# EAGLE schematic main (EAGLE 8.0.0), part 3 of 4
## Sheet 32 of 48: PC_ADDER 8-15
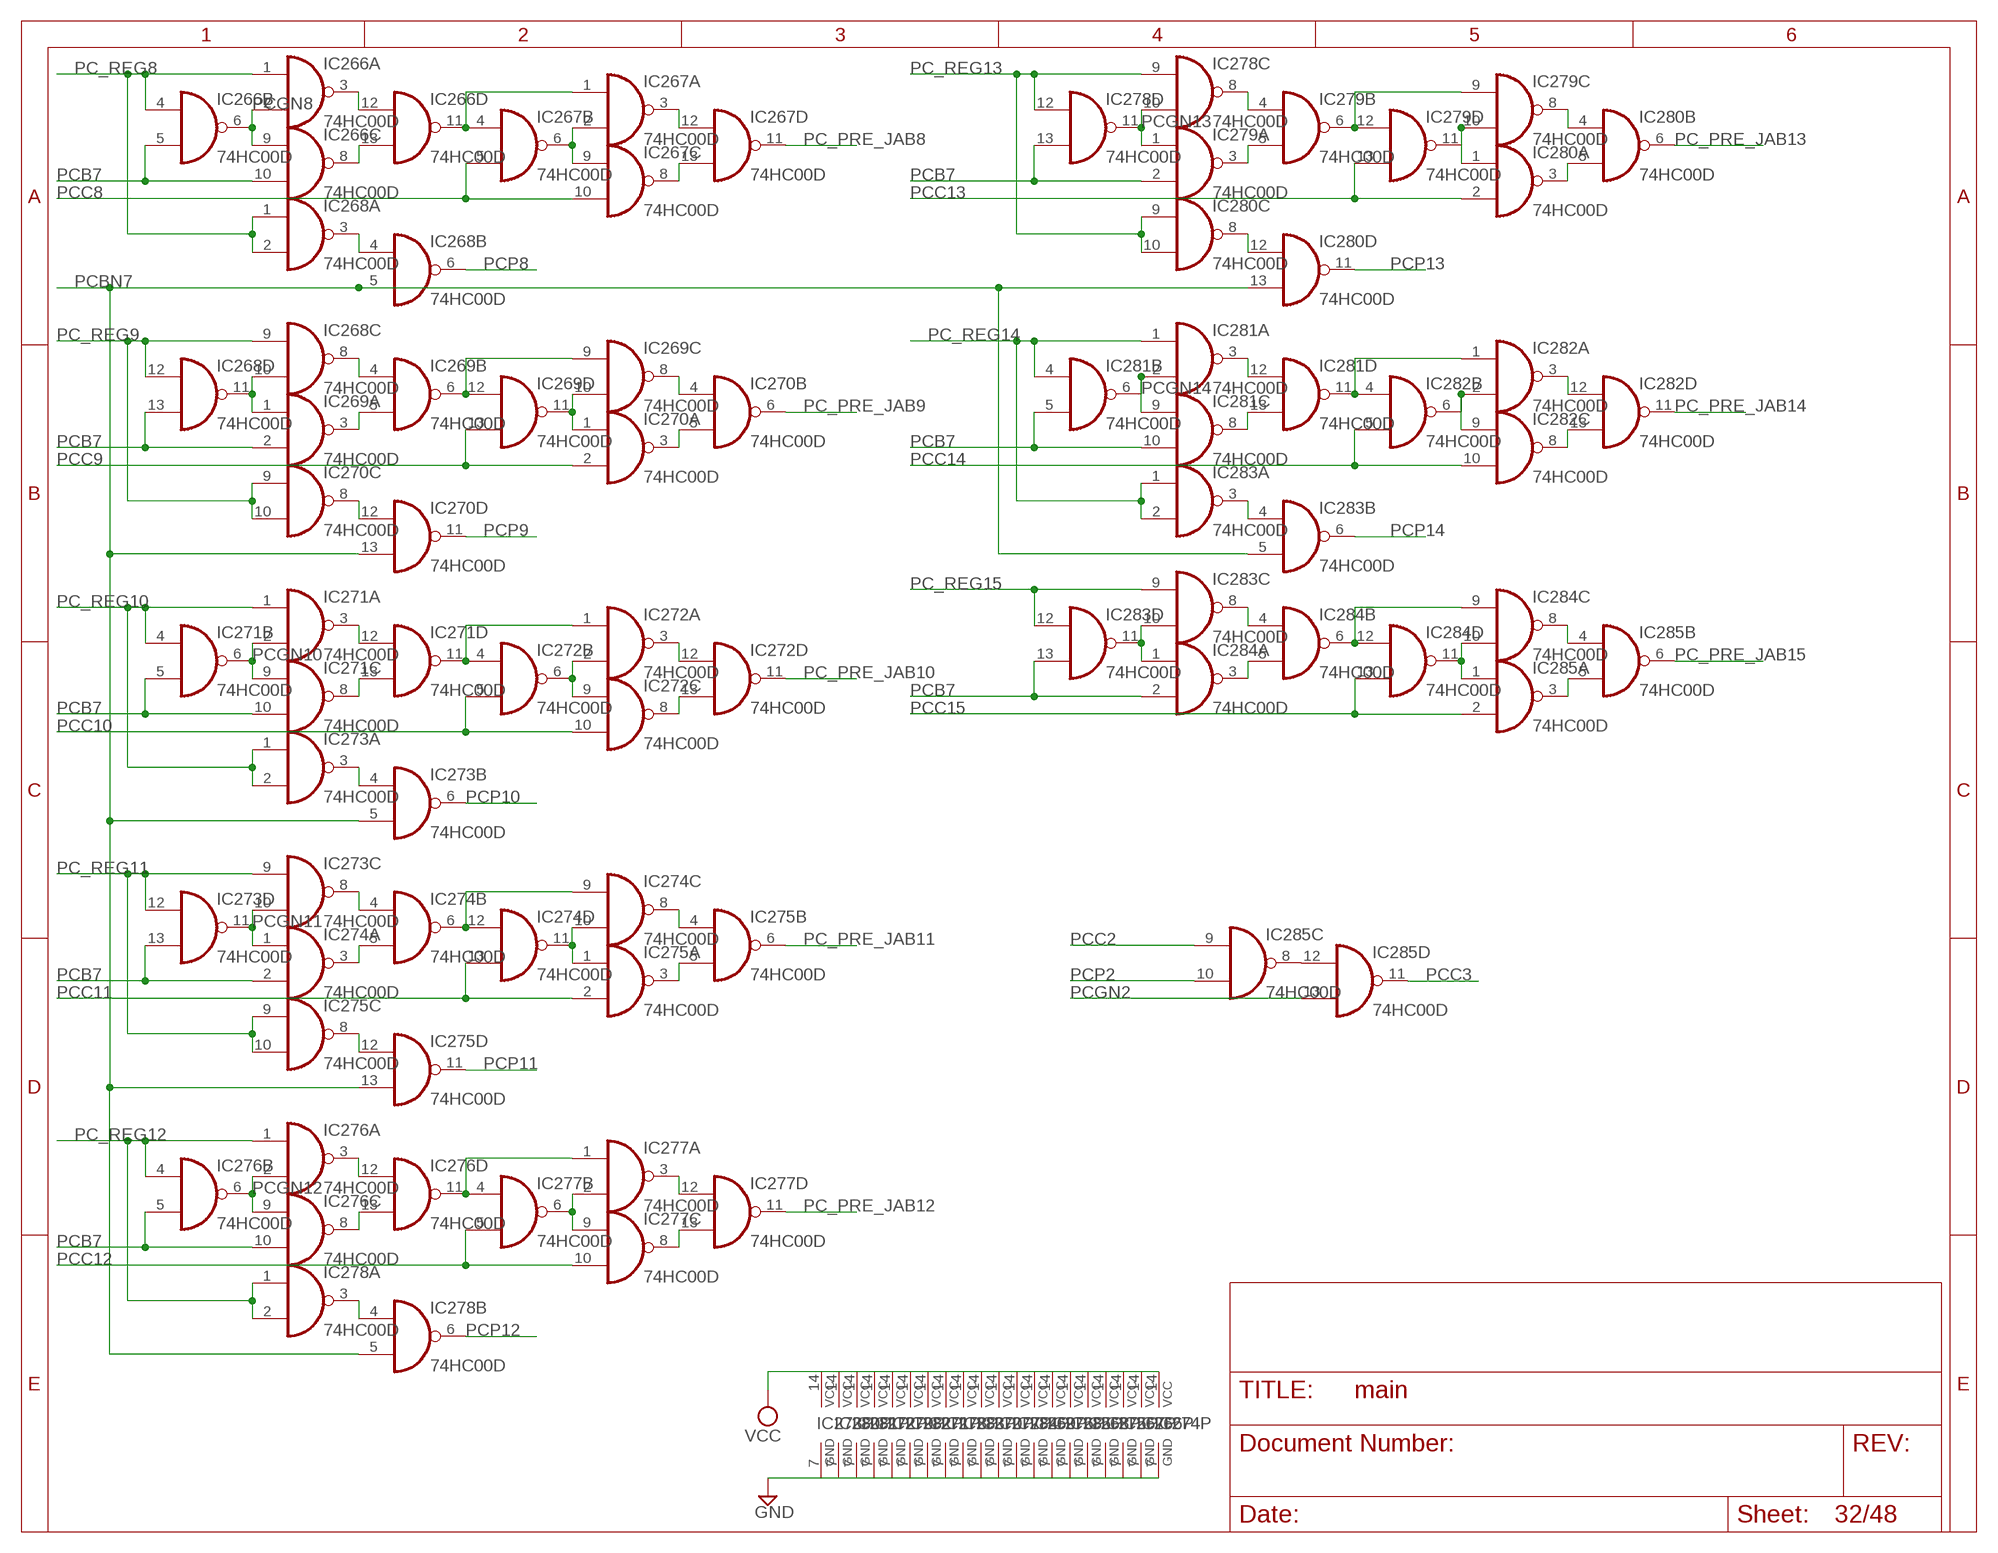
[diagram p31: schematic, sheet 32]

### Parts
IC266  74HC00D  [SO14]
IC267  74HC00D  [SO14]
IC268  74HC00D  [SO14]
IC269  74HC00D  [SO14]
IC270  74HC00D  [SO14]
IC271  74HC00D  [SO14]
IC272  74HC00D  [SO14]
IC273  74HC00D  [SO14]
IC274  74HC00D  [SO14]
IC275  74HC00D  [SO14]
IC276  74HC00D  [SO14]
IC277  74HC00D  [SO14]
IC278  74HC00D  [SO14]
IC279  74HC00D  [SO14]
IC280  74HC00D  [SO14]
IC281  74HC00D  [SO14]
IC282  74HC00D  [SO14]
IC283  74HC00D  [SO14]
IC284  74HC00D  [SO14]
IC285  74HC00D  [SO14]

### Nets
GND: IC274.7(P:GND) ; also sheet 1,2,3,4,5,6,7,8,9,10,11,12,13,14,15,16,17,18,19,20,21,22,23,24,25,26,27,28,29,30,31,33,34,37,38,39,40,41,42,43,44,45,46,47
N$691: IC285.8(C:O) IC285.12(D:I0)
N$729: IC266.11(D:O) IC267.1(A:I0) IC267.4(B:I0)
N$731: IC269.6(B:O) IC269.9(C:I0) IC269.12(D:I0)
N$734: IC271.11(D:O) IC272.1(A:I0) IC272.4(B:I0)
N$735: IC274.6(B:O) IC274.9(C:I0) IC274.12(D:I0)
N$736: IC276.11(D:O) IC277.1(A:I0) IC277.4(B:I0)
N$737: IC279.6(B:O) IC279.9(C:I0) IC279.12(D:I0)
N$746: IC281.11(D:O) IC282.1(A:I0) IC282.4(B:I0)
N$750: IC282.2(A:I1) IC282.6(B:O) IC282.9(C:I0)
N$751: IC282.8(C:O) IC282.13(D:I1)
N$765: IC282.3(A:O) IC282.12(D:I0)
N$775: IC279.10(C:I1) IC279.11(D:O) IC280.1(A:I0)
N$803: IC280.3(A:O) IC280.5(B:I1)
N$809: IC279.8(C:O) IC280.4(B:I0)
N$816: IC284.6(B:O) IC284.9(C:I0) IC284.12(D:I0)
N$817: IC283.8(C:O) IC284.4(B:I0)
N$818: IC284.3(A:O) IC284.5(B:I1)
N$820: IC281.8(C:O) IC281.13(D:I1)
N$821: IC281.3(A:O) IC281.12(D:I0)
N$822: IC283.10(C:I1) IC283.11(D:O) IC284.1(A:I0)
N$825: IC284.10(C:I1) IC284.11(D:O) IC285.1(A:I0)
N$827: IC283.3(A:O) IC283.4(B:I0)
N$831: IC278.8(C:O) IC279.4(B:I0)
N$832: IC279.3(A:O) IC279.5(B:I1)
N$836: IC285.3(A:O) IC285.5(B:I1)
N$837: IC284.8(C:O) IC285.4(B:I0)
N$839: IC280.8(C:O) IC280.12(D:I0)
N$840: IC266.8(C:O) IC266.13(D:I1)
N$842: IC266.3(A:O) IC266.12(D:I0)
N$846: IC268.3(A:O) IC268.4(B:I0)
N$848: IC267.2(A:I1) IC267.6(B:O) IC267.9(C:I0)
N$849: IC267.3(A:O) IC267.12(D:I0)
N$850: IC267.8(C:O) IC267.13(D:I1)
N$852: IC270.8(C:O) IC270.12(D:I0)
N$856: IC269.3(A:O) IC269.5(B:I1)
N$857: IC268.8(C:O) IC269.4(B:I0)
N$859: IC269.10(C:I1) IC269.11(D:O) IC270.1(A:I0)
N$860: IC269.8(C:O) IC270.4(B:I0)
N$861: IC270.3(A:O) IC270.5(B:I1)
N$865: IC271.3(A:O) IC271.12(D:I0)
N$866: IC271.8(C:O) IC271.13(D:I1)
N$868: IC272.2(A:I1) IC272.6(B:O) IC272.9(C:I0)
N$869: IC272.3(A:O) IC272.12(D:I0)
N$870: IC272.8(C:O) IC272.13(D:I1)
N$874: IC273.3(A:O) IC273.4(B:I0)
N$875: IC273.8(C:O) IC274.4(B:I0)
N$879: IC274.3(A:O) IC274.5(B:I1)
N$881: IC274.10(C:I1) IC274.11(D:O) IC275.1(A:I0)
N$882: IC274.8(C:O) IC275.4(B:I0)
N$883: IC275.3(A:O) IC275.5(B:I1)
N$884: IC275.8(C:O) IC275.12(D:I0)
N$890: IC278.3(A:O) IC278.4(B:I0)
N$891: IC276.8(C:O) IC276.13(D:I1)
N$892: IC276.3(A:O) IC276.12(D:I0)
N$894: IC277.2(A:I1) IC277.6(B:O) IC277.9(C:I0)
N$902: IC277.3(A:O) IC277.12(D:I0)
N$903: IC277.8(C:O) IC277.13(D:I1)
PC_PRE_JAB8: IC267.11(D:O) ; also sheet 34
PC_PRE_JAB9: IC270.6(B:O) ; also sheet 34
PC_PRE_JAB10: IC272.11(D:O) ; also sheet 34
PC_PRE_JAB11: IC275.6(B:O) ; also sheet 34
PC_PRE_JAB12: IC277.11(D:O) ; also sheet 34
PC_PRE_JAB13: IC280.6(B:O) ; also sheet 34
PC_PRE_JAB14: IC282.11(D:O) ; also sheet 34
PC_PRE_JAB15: IC285.6(B:O) ; also sheet 34
PC_REG8: IC266.1(A:I0) IC266.4(B:I0) IC268.1(A:I0) IC268.2(A:I1) ; also sheet 47
PC_REG9: IC268.9(C:I0) IC268.12(D:I0) IC270.9(C:I0) IC270.10(C:I1) ; also sheet 47
PC_REG10: IC271.1(A:I0) IC271.4(B:I0) IC273.1(A:I0) IC273.2(A:I1) ; also sheet 47
PC_REG11: IC273.9(C:I0) IC273.12(D:I0) IC275.9(C:I0) IC275.10(C:I1) ; also sheet 47
PC_REG12: IC276.1(A:I0) IC276.4(B:I0) IC278.1(A:I0) IC278.2(A:I1) ; also sheet 47
PC_REG13: IC278.9(C:I0) IC278.12(D:I0) IC280.9(C:I0) IC280.10(C:I1) ; also sheet 47
PC_REG14: IC281.1(A:I0) IC281.4(B:I0) IC283.1(A:I0) IC283.2(A:I1) ; also sheet 47
PC_REG15: IC283.9(C:I0) IC283.12(D:I0) ; also sheet 47
PCB7: IC266.5(B:I1) IC266.10(C:I1) IC268.13(D:I1) IC269.2(A:I1) IC271.5(B:I1) IC271.10(C:I1) IC273.13(D:I1) IC274.2(A:I1) IC276.5(B:I1) IC276.10(C:I1) IC278.13(D:I1) IC279.2(A:I1) IC281.5(B:I1) IC281.10(C:I1) IC283.13(D:I1) IC284.2(A:I1) ; also sheet 29,31
PCBN7: IC268.5(B:I1) IC270.13(D:I1) IC273.5(B:I1) IC275.13(D:I1) IC278.5(B:I1) IC280.13(D:I1) IC283.5(B:I1) ; also sheet 31
PCC2: IC285.9(C:I0) ; also sheet 29,31
PCC3: IC285.11(D:O) ; also sheet 31,33
PCC8: IC267.5(B:I1) IC267.10(C:I1) ; also sheet 33
PCC9: IC269.13(D:I1) IC270.2(A:I1) ; also sheet 33
PCC10: IC272.5(B:I1) IC272.10(C:I1) ; also sheet 33
PCC11: IC274.13(D:I1) IC275.2(A:I1) ; also sheet 33
PCC12: IC277.5(B:I1) IC277.10(C:I1) ; also sheet 33
PCC13: IC279.13(D:I1) IC280.2(A:I1) ; also sheet 33
PCC14: IC282.5(B:I1) IC282.10(C:I1) ; also sheet 33
PCC15: IC284.13(D:I1) IC285.2(A:I1) ; also sheet 33
PCGN2: IC285.13(D:I1) ; also sheet 31
PCGN8: IC266.2(A:I1) IC266.6(B:O) IC266.9(C:I0) ; also sheet 33
PCGN9: IC268.10(C:I1) IC268.11(D:O) IC269.1(A:I0) ; also sheet 33
PCGN10: IC271.2(A:I1) IC271.6(B:O) IC271.9(C:I0) ; also sheet 33
PCGN11: IC273.10(C:I1) IC273.11(D:O) IC274.1(A:I0) ; also sheet 33
PCGN12: IC276.2(A:I1) IC276.6(B:O) IC276.9(C:I0) ; also sheet 33
PCGN13: IC278.10(C:I1) IC278.11(D:O) IC279.1(A:I0) ; also sheet 33
PCGN14: IC281.2(A:I1) IC281.6(B:O) IC281.9(C:I0) ; also sheet 33
PCP2: IC285.10(C:I1) ; also sheet 31
PCP8: IC268.6(B:O) ; also sheet 33
PCP9: IC270.11(D:O) ; also sheet 33
PCP10: IC273.6(B:O) ; also sheet 33
PCP11: IC275.11(D:O) ; also sheet 33
PCP12: IC278.6(B:O) ; also sheet 33
PCP13: IC280.11(D:O) ; also sheet 33
PCP14: IC283.6(B:O) ; also sheet 33
VCC: IC274.14(P:VCC) ; also sheet 1,2,3,4,5,6,7,8,9,10,11,12,13,14,15,16,17,18,19,20,21,22,23,24,25,26,27,28,29,30,31,33,34,37,38,39,40,41,42,43,44,45,46,47

## Sheet 33 of 48: PC CLU
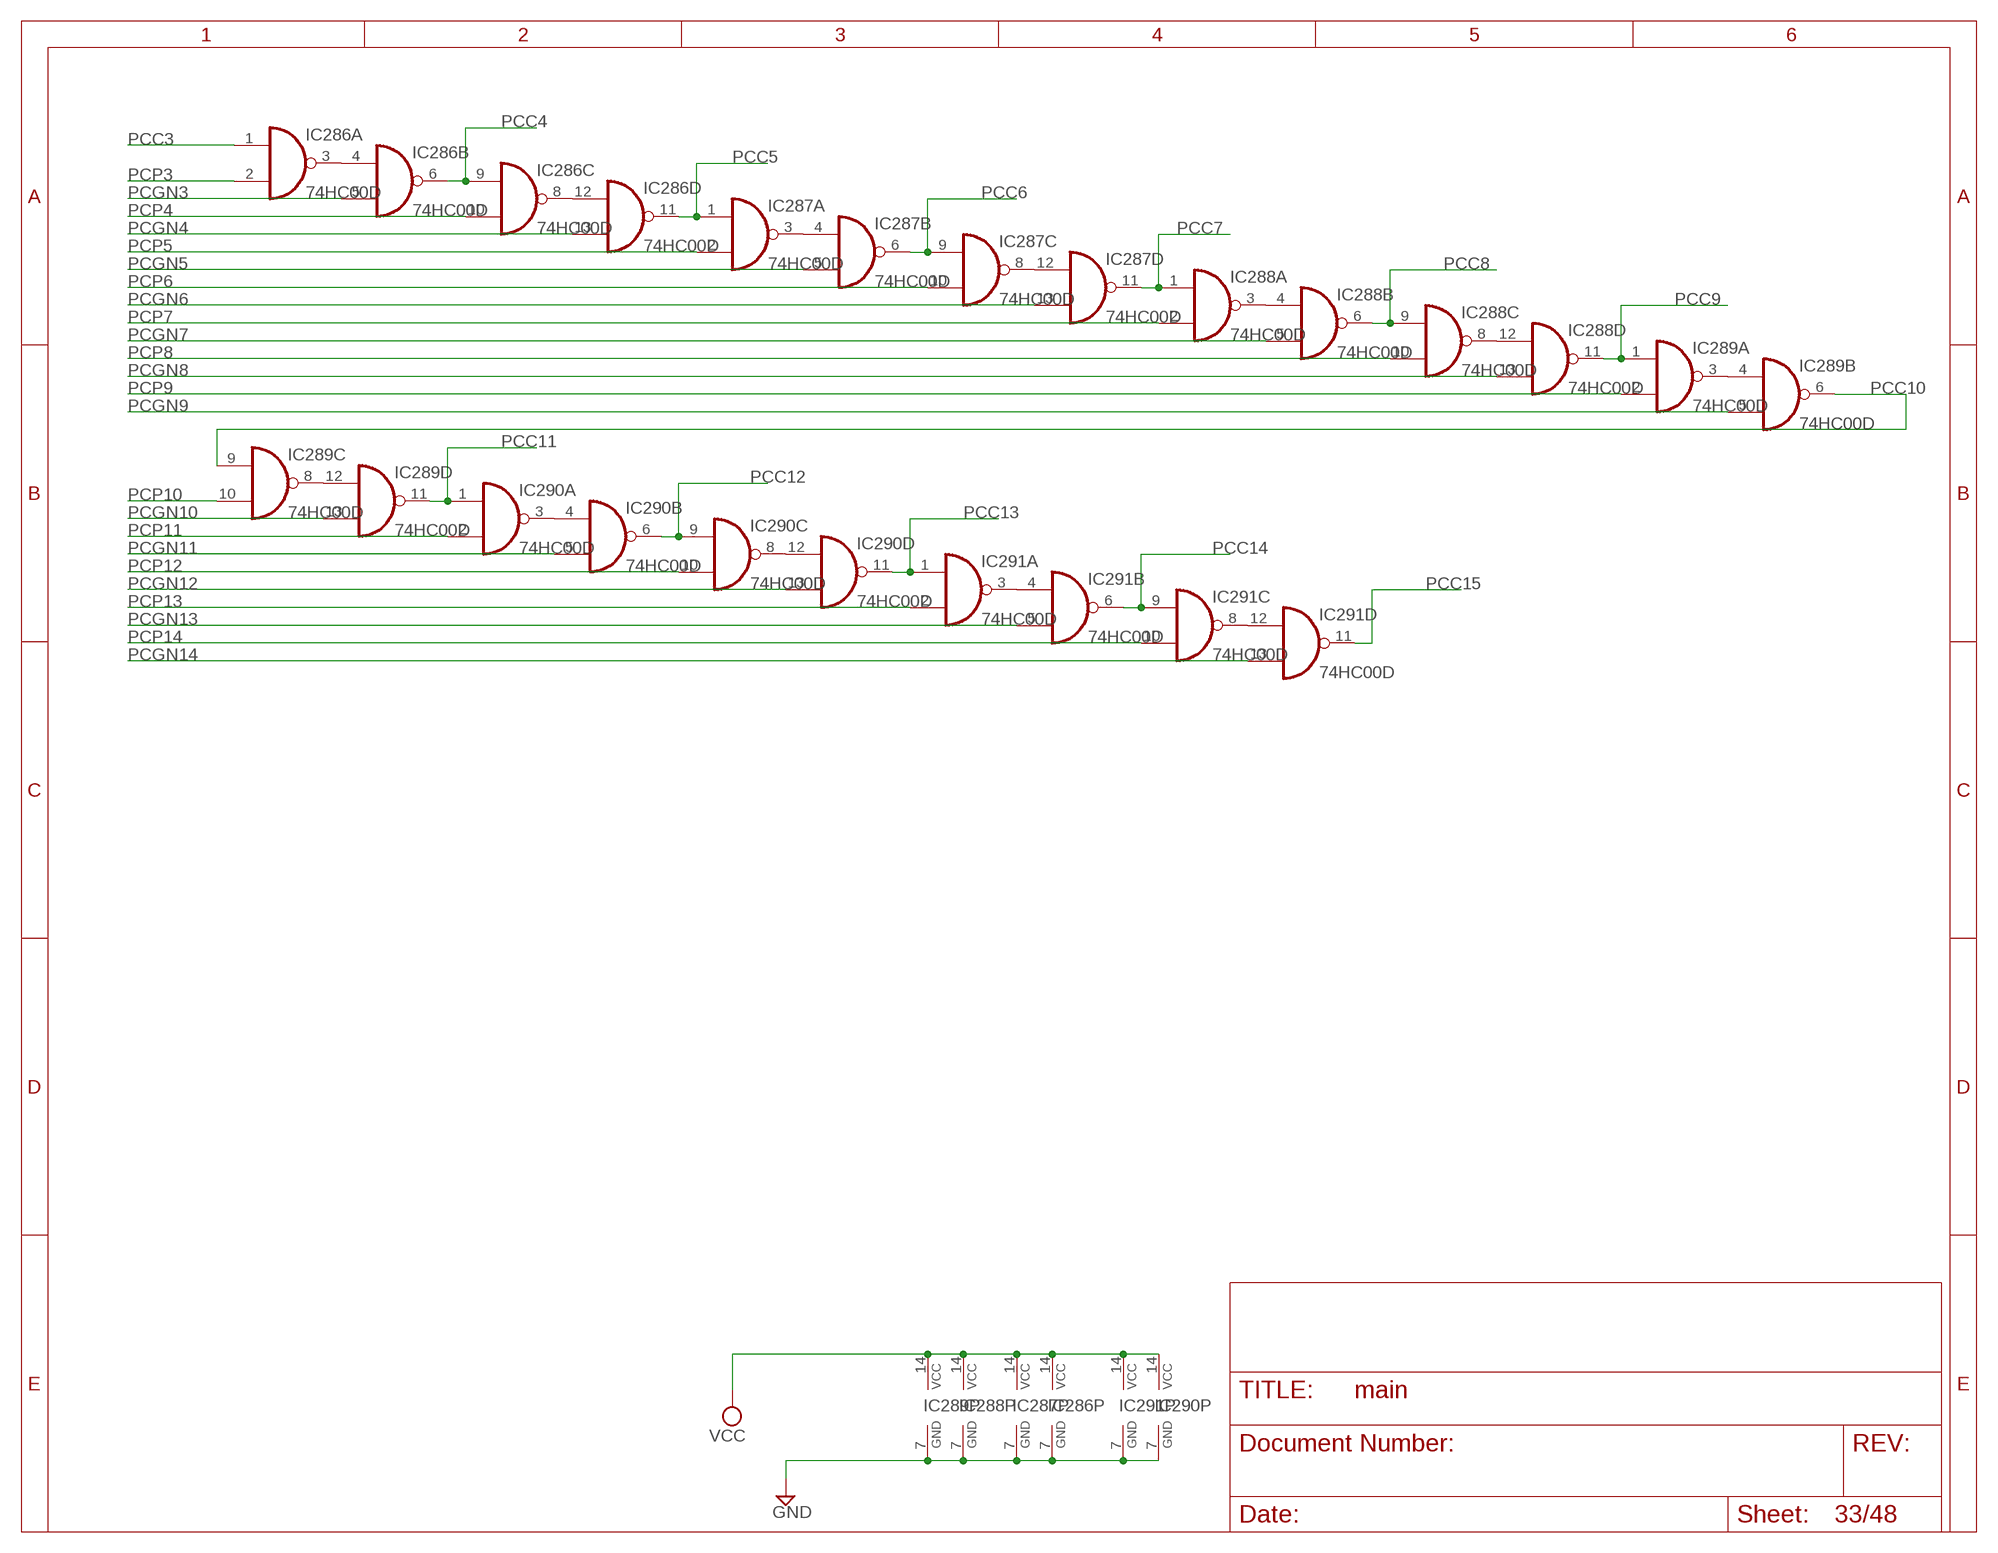
[diagram p32: schematic, sheet 33]

### Parts
IC286  74HC00D  [SO14]
IC287  74HC00D  [SO14]
IC288  74HC00D  [SO14]
IC289  74HC00D  [SO14]
IC290  74HC00D  [SO14]
IC291  74HC00D  [SO14]

### Nets
GND: IC286.7(P:GND) IC287.7(P:GND) IC288.7(P:GND) IC289.7(P:GND) IC290.7(P:GND) IC291.7(P:GND) ; also sheet 1,2,3,4,5,6,7,8,9,10,11,12,13,14,15,16,17,18,19,20,21,22,23,24,25,26,27,28,29,30,31,32,34,37,38,39,40,41,42,43,44,45,46,47
N$726: IC286.3(A:O) IC286.4(B:I0)
N$730: IC288.3(A:O) IC288.4(B:I0)
N$732: IC286.8(C:O) IC286.12(D:I0)
N$733: IC288.8(C:O) IC288.12(D:I0)
N$738: IC287.3(A:O) IC287.4(B:I0)
N$739: IC289.3(A:O) IC289.4(B:I0)
N$740: IC287.8(C:O) IC287.12(D:I0)
N$741: IC289.8(C:O) IC289.12(D:I0)
N$758: IC290.3(A:O) IC290.4(B:I0)
N$761: IC290.8(C:O) IC290.12(D:I0)
N$762: IC291.3(A:O) IC291.4(B:I0)
N$769: IC291.8(C:O) IC291.12(D:I0)
PCC3: IC286.1(A:I0) ; also sheet 31,32
PCC4: IC286.6(B:O) IC286.9(C:I0) ; also sheet 31
PCC5: IC286.11(D:O) IC287.1(A:I0) ; also sheet 31
PCC6: IC287.6(B:O) IC287.9(C:I0) ; also sheet 31
PCC7: IC287.11(D:O) IC288.1(A:I0) ; also sheet 31
PCC8: IC288.6(B:O) IC288.9(C:I0) ; also sheet 32
PCC9: IC288.11(D:O) IC289.1(A:I0) ; also sheet 32
PCC10: IC289.6(B:O) IC289.9(C:I0) ; also sheet 32
PCC11: IC289.11(D:O) IC290.1(A:I0) ; also sheet 32
PCC12: IC290.6(B:O) IC290.9(C:I0) ; also sheet 32
PCC13: IC290.11(D:O) IC291.1(A:I0) ; also sheet 32
PCC14: IC291.6(B:O) IC291.9(C:I0) ; also sheet 32
PCC15: IC291.11(D:O) ; also sheet 32
PCGN3: IC286.5(B:I1) ; also sheet 31
PCGN4: IC286.13(D:I1) ; also sheet 31
PCGN5: IC287.5(B:I1) ; also sheet 31
PCGN6: IC287.13(D:I1) ; also sheet 31
PCGN7: IC288.5(B:I1) ; also sheet 31
PCGN8: IC288.13(D:I1) ; also sheet 32
PCGN9: IC289.5(B:I1) ; also sheet 32
PCGN10: IC289.13(D:I1) ; also sheet 32
PCGN11: IC290.5(B:I1) ; also sheet 32
PCGN12: IC290.13(D:I1) ; also sheet 32
PCGN13: IC291.5(B:I1) ; also sheet 32
PCGN14: IC291.13(D:I1) ; also sheet 32
PCP3: IC286.2(A:I1) ; also sheet 31
PCP4: IC286.10(C:I1) ; also sheet 31
PCP5: IC287.2(A:I1) ; also sheet 31
PCP6: IC287.10(C:I1) ; also sheet 31
PCP7: IC288.2(A:I1) ; also sheet 31
PCP8: IC288.10(C:I1) ; also sheet 32
PCP9: IC289.2(A:I1) ; also sheet 32
PCP10: IC289.10(C:I1) ; also sheet 32
PCP11: IC290.2(A:I1) ; also sheet 32
PCP12: IC290.10(C:I1) ; also sheet 32
PCP13: IC291.2(A:I1) ; also sheet 32
PCP14: IC291.10(C:I1) ; also sheet 32
VCC: IC286.14(P:VCC) IC287.14(P:VCC) IC288.14(P:VCC) IC289.14(P:VCC) IC290.14(P:VCC) IC291.14(P:VCC) ; also sheet 1,2,3,4,5,6,7,8,9,10,11,12,13,14,15,16,17,18,19,20,21,22,23,24,25,26,27,28,29,30,31,32,34,37,38,39,40,41,42,43,44,45,46,47

## Sheet 34 of 48: PC JAB SEL, OP DATA SELECTOR
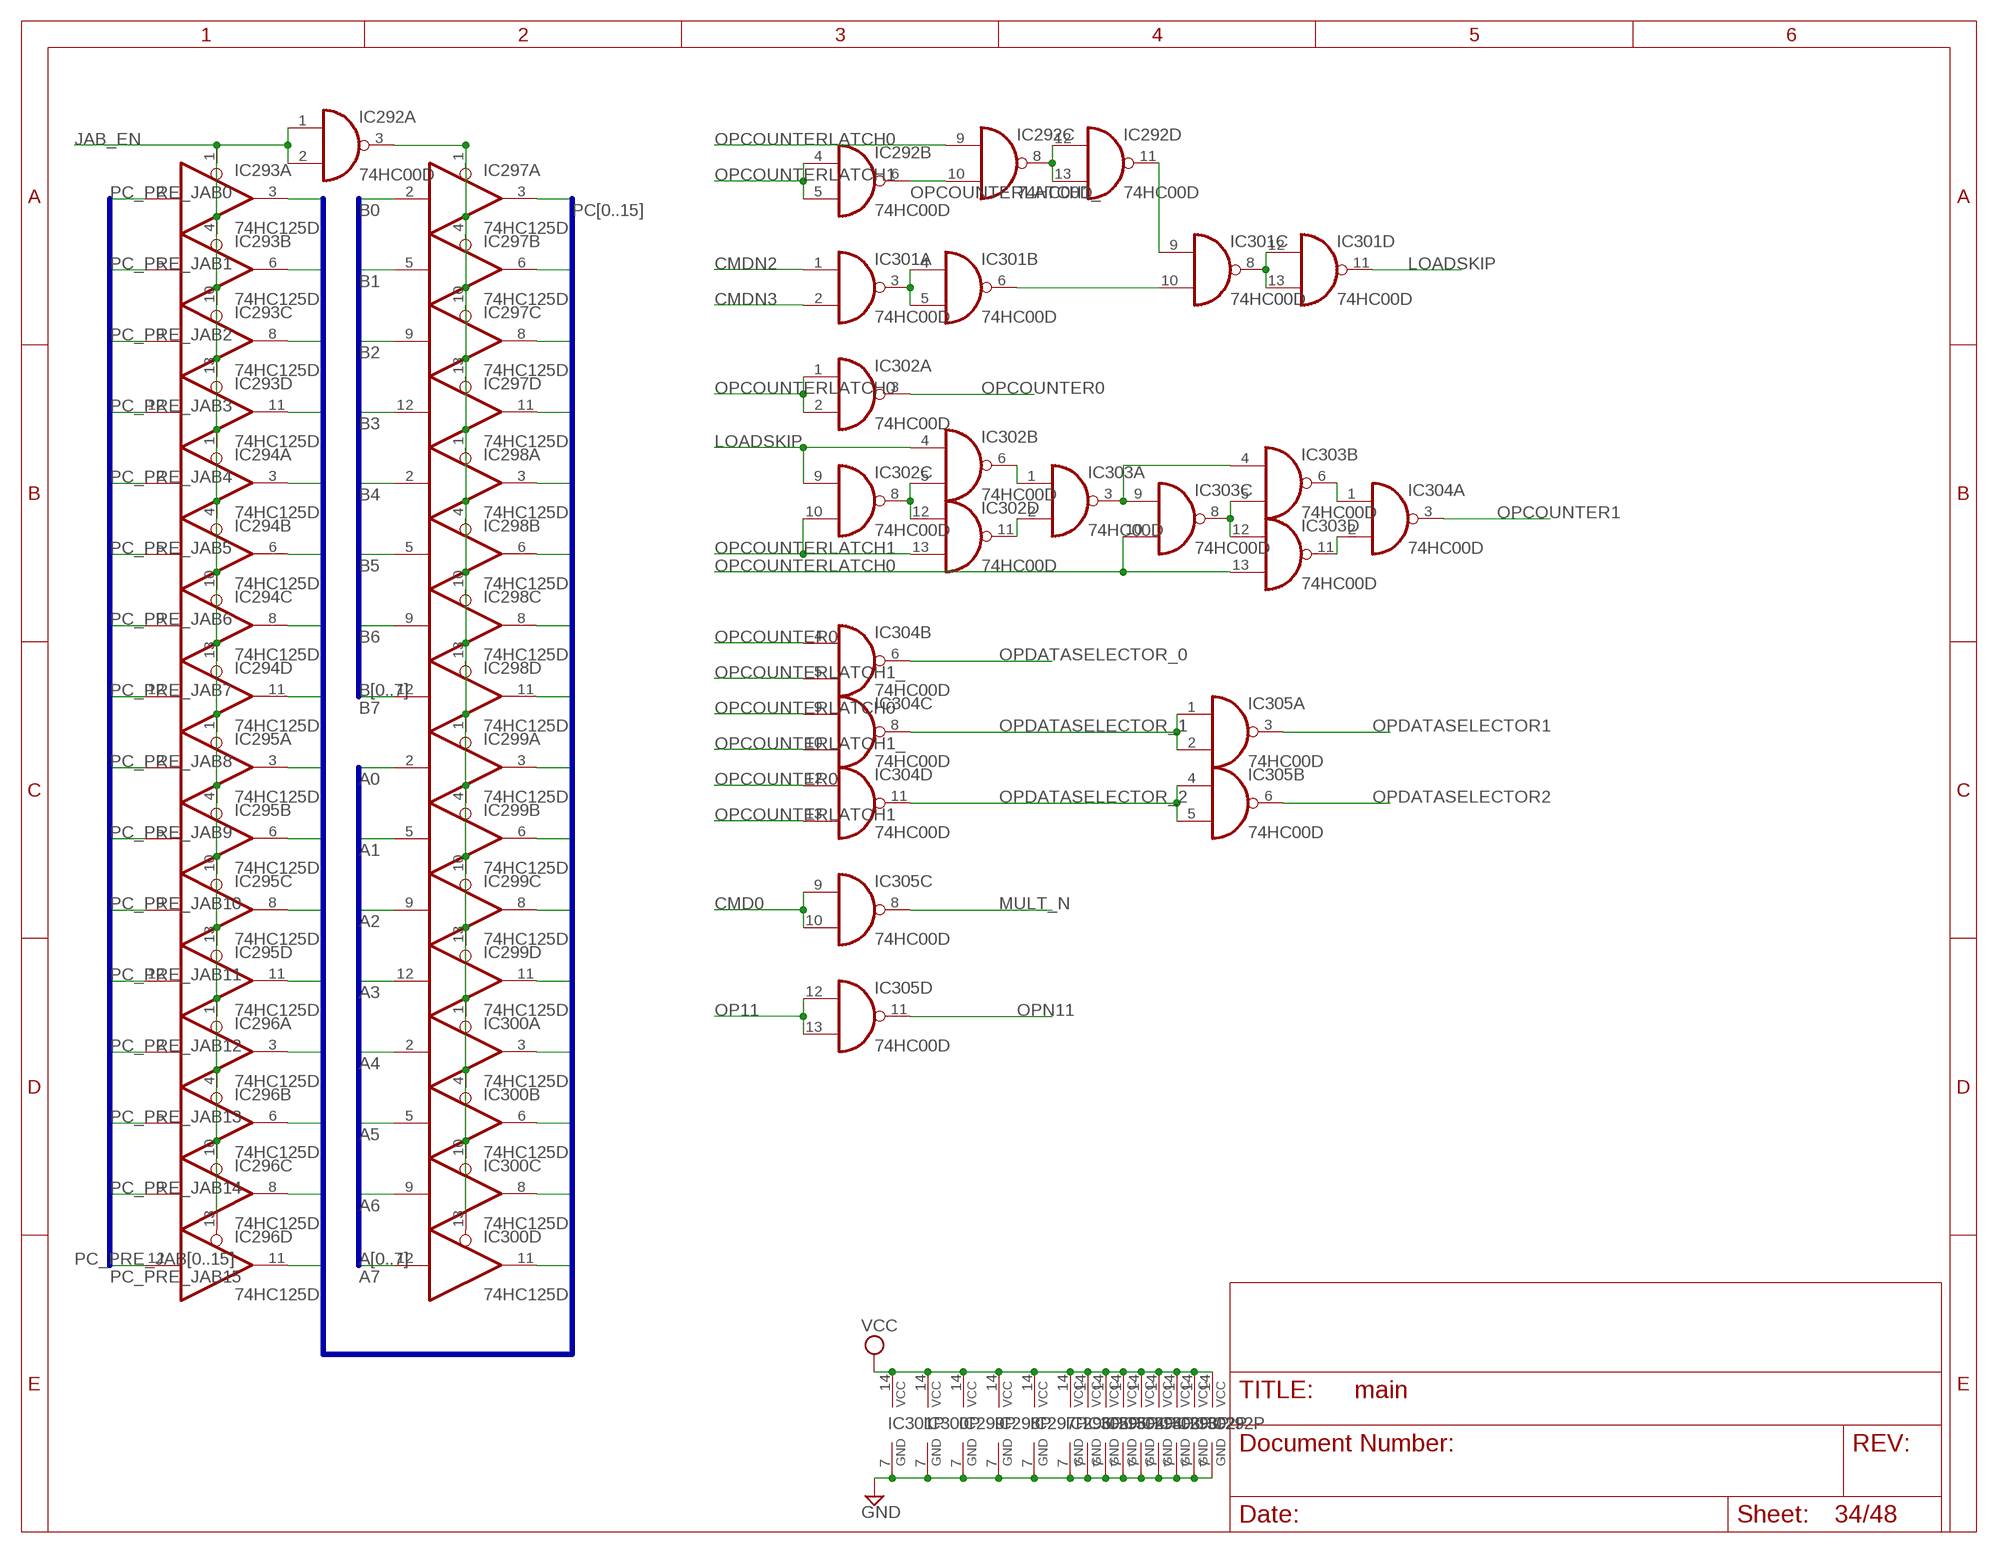
[diagram p33: schematic, sheet 34]

### Parts
IC292  74HC00D  [SO14]
IC293  74HC125D  [SO14]
IC294  74HC125D  [SO14]
IC295  74HC125D  [SO14]
IC296  74HC125D  [SO14]
IC297  74HC125D  [SO14]
IC298  74HC125D  [SO14]
IC299  74HC125D  [SO14]
IC300  74HC125D  [SO14]
IC301  74HC00D  [SO14]
IC302  74HC00D  [SO14]
IC303  74HC00D  [SO14]
IC304  74HC00D  [SO14]
IC305  74HC00D  [SO14]

### Nets
A0: IC299.2(A:I) ; also sheet 1,3,4,11,24,25,26,30,41
A1: IC299.5(B:I) ; also sheet 1,3,4,11,19,24,25,26,30,41
A2: IC299.9(C:I) ; also sheet 1,24,25,26,30,41
A3: IC299.12(D:I) ; also sheet 1,2,5,6,11,22,24,25,26,30,41
A4: IC300.2(A:I) ; also sheet 2,24,25,27,30,40
A5: IC300.5(B:I) ; also sheet 2,7,8,11,16,24,25,27,30,40
A6: IC300.9(C:I) ; also sheet 2,24,25,27,30,40
A7: IC300.12(D:I) ; also sheet 2,9,10,11,15,24,25,27,30,40
B0: IC297.2(A:I) ; also sheet 4,6,8,10,11,24,25,26,43
B1: IC297.5(B:I) ; also sheet 4,6,8,10,24,25,26,43
B2: IC297.9(C:I) ; also sheet 4,6,8,10,24,25,26,43
B3: IC297.12(D:I) ; also sheet 4,6,8,10,24,25,26,43
B4: IC298.2(A:I) ; also sheet 3,4,5,6,7,8,9,10,24,25,27,42
B5: IC298.5(B:I) ; also sheet 3,5,7,9,24,25,27,42
B6: IC298.9(C:I) ; also sheet 3,5,7,9,24,25,27,42
B7: IC298.12(D:I) ; also sheet 3,5,7,9,24,25,27,42
CMD0: IC305.9(C:I0) IC305.10(C:I1) ; also sheet 37
CMDN2: IC301.1(A:I0) ; also sheet 37,46,47
CMDN3: IC301.2(A:I1) ; also sheet 37,47
GND: IC292.7(P:GND) IC293.7(P:GND) IC294.7(P:GND) IC295.7(P:GND) IC296.7(P:GND) IC297.7(P:GND) IC298.7(P:GND) IC299.7(P:GND) IC300.7(P:GND) IC301.7(P:GND) IC302.7(P:GND) IC303.7(P:GND) IC304.7(P:GND) IC305.7(P:GND) ; also sheet 1,2,3,4,5,6,7,8,9,10,11,12,13,14,15,16,17,18,19,20,21,22,23,24,25,26,27,28,29,30,31,32,33,37,38,39,40,41,42,43,44,45,46,47
JAB_EN: IC292.1(A:I0) IC292.2(A:I1) IC293.1(A:OE) IC293.4(B:OE) IC293.10(C:OE) IC293.13(D:OE) IC294.1(A:OE) IC294.4(B:OE) IC294.10(C:OE) IC294.13(D:OE) IC295.1(A:OE) IC295.4(B:OE) IC295.10(C:OE) IC295.13(D:OE) IC296.1(A:OE) IC296.4(B:OE) IC296.10(C:OE) IC296.13(D:OE) ; also sheet 46
LOADSKIP: IC301.11(D:O) IC302.4(B:I0) IC302.9(C:I0)
MULT_N: IC305.8(C:O)
N$770: IC303.3(A:O) IC303.4(B:I0) IC303.9(C:I0)
N$771: IC302.6(B:O) IC303.1(A:I0)
N$774: IC292.3(A:O) IC297.1(A:OE) IC297.4(B:OE) IC297.10(C:OE) IC297.13(D:OE) IC298.1(A:OE) IC298.4(B:OE) IC298.10(C:OE) IC298.13(D:OE) IC299.1(A:OE) IC299.4(B:OE) IC299.10(C:OE) IC299.13(D:OE) IC300.1(A:OE) IC300.4(B:OE) IC300.10(C:OE) IC300.13(D:OE)
N$781: IC292.8(C:O) IC292.12(D:I0) IC292.13(D:I1)
N$783: IC292.11(D:O) IC301.9(C:I0)
N$784: IC301.8(C:O) IC301.12(D:I0) IC301.13(D:I1)
N$785: IC301.3(A:O) IC301.4(B:I0) IC301.5(B:I1)
N$788: IC301.6(B:O) IC301.10(C:I1)
N$791: IC302.11(D:O) IC303.2(A:I1)
N$797: IC303.5(B:I1) IC303.8(C:O) IC303.12(D:I0)
N$799: IC303.6(B:O) IC304.1(A:I0)
N$802: IC303.11(D:O) IC304.2(A:I1)
N$805: IC302.5(B:I1) IC302.8(C:O) IC302.12(D:I0)
OP11: IC305.12(D:I0) IC305.13(D:I1) ; also sheet 36,47
OPCOUNTER0: IC302.3(A:O) IC304.4(B:I0) IC304.12(D:I0)
OPCOUNTER1: IC304.3(A:O)
OPCOUNTERLATCH0: IC292.9(C:I0) IC302.1(A:I0) IC302.2(A:I1) IC303.10(C:I1) IC303.13(D:I1) IC304.9(C:I0)
OPCOUNTERLATCH1: IC292.4(B:I0) IC292.5(B:I1) IC302.10(C:I1) IC302.13(D:I1) IC304.13(D:I1)
OPCOUNTERLATCH1_: IC292.6(B:O) IC292.10(C:I1) IC304.5(B:I1) IC304.10(C:I1)
OPDATASELECTOR1: IC305.3(A:O) ; also sheet 46
OPDATASELECTOR2: IC305.6(B:O)
OPDATASELECTOR_0: IC304.6(B:O)
OPDATASELECTOR_1: IC304.8(C:O) IC305.1(A:I0) IC305.2(A:I1)
OPDATASELECTOR_2: IC304.11(D:O) IC305.4(B:I0) IC305.5(B:I1)
OPN11: IC305.11(D:O) ; also sheet 36
PC0: IC293.3(A:O) IC297.3(A:O)
PC1: IC293.6(B:O) IC297.6(B:O)
PC2: IC293.8(C:O) IC297.8(C:O)
PC3: IC293.11(D:O) IC297.11(D:O)
PC4: IC294.3(A:O) IC298.3(A:O)
PC5: IC294.6(B:O) IC298.6(B:O)
PC6: IC294.8(C:O) IC298.8(C:O)
PC7: IC294.11(D:O) IC298.11(D:O)
PC8: IC295.3(A:O) IC299.3(A:O)
PC9: IC295.6(B:O) IC299.6(B:O)
PC10: IC295.8(C:O) IC299.8(C:O)
PC11: IC295.11(D:O) IC299.11(D:O)
PC12: IC296.3(A:O) IC300.3(A:O)
PC13: IC296.6(B:O) IC300.6(B:O)
PC14: IC296.8(C:O) IC300.8(C:O)
PC15: IC296.11(D:O) IC300.11(D:O)
PC_PRE_JAB0: IC293.2(A:I) ; also sheet 31
PC_PRE_JAB1: IC293.5(B:I) ; also sheet 31
PC_PRE_JAB2: IC293.9(C:I) ; also sheet 31
PC_PRE_JAB3: IC293.12(D:I) ; also sheet 31
PC_PRE_JAB4: IC294.2(A:I) ; also sheet 31
PC_PRE_JAB5: IC294.5(B:I) ; also sheet 31
PC_PRE_JAB6: IC294.9(C:I) ; also sheet 31
PC_PRE_JAB7: IC294.12(D:I) ; also sheet 31
PC_PRE_JAB8: IC295.2(A:I) ; also sheet 32
PC_PRE_JAB9: IC295.5(B:I) ; also sheet 32
PC_PRE_JAB10: IC295.9(C:I) ; also sheet 32
PC_PRE_JAB11: IC295.12(D:I) ; also sheet 32
PC_PRE_JAB12: IC296.2(A:I) ; also sheet 32
PC_PRE_JAB13: IC296.5(B:I) ; also sheet 32
PC_PRE_JAB14: IC296.9(C:I) ; also sheet 32
PC_PRE_JAB15: IC296.12(D:I) ; also sheet 32
VCC: IC292.14(P:VCC) IC293.14(P:VCC) IC294.14(P:VCC) IC295.14(P:VCC) IC296.14(P:VCC) IC297.14(P:VCC) IC298.14(P:VCC) IC299.14(P:VCC) IC300.14(P:VCC) IC301.14(P:VCC) IC302.14(P:VCC) IC303.14(P:VCC) IC304.14(P:VCC) IC305.14(P:VCC) ; also sheet 1,2,3,4,5,6,7,8,9,10,11,12,13,14,15,16,17,18,19,20,21,22,23,24,25,26,27,28,29,30,31,32,33,37,38,39,40,41,42,43,44,45,46,47

### Buses
B[0..7]
A[0..7]
PC[0..15]
PC_PRE_JAB[0..15]

## Sheet 35 of 48: REGISTERS

## Sheet 36 of 48: REG_WR_SEL, REG_LIMIT_K
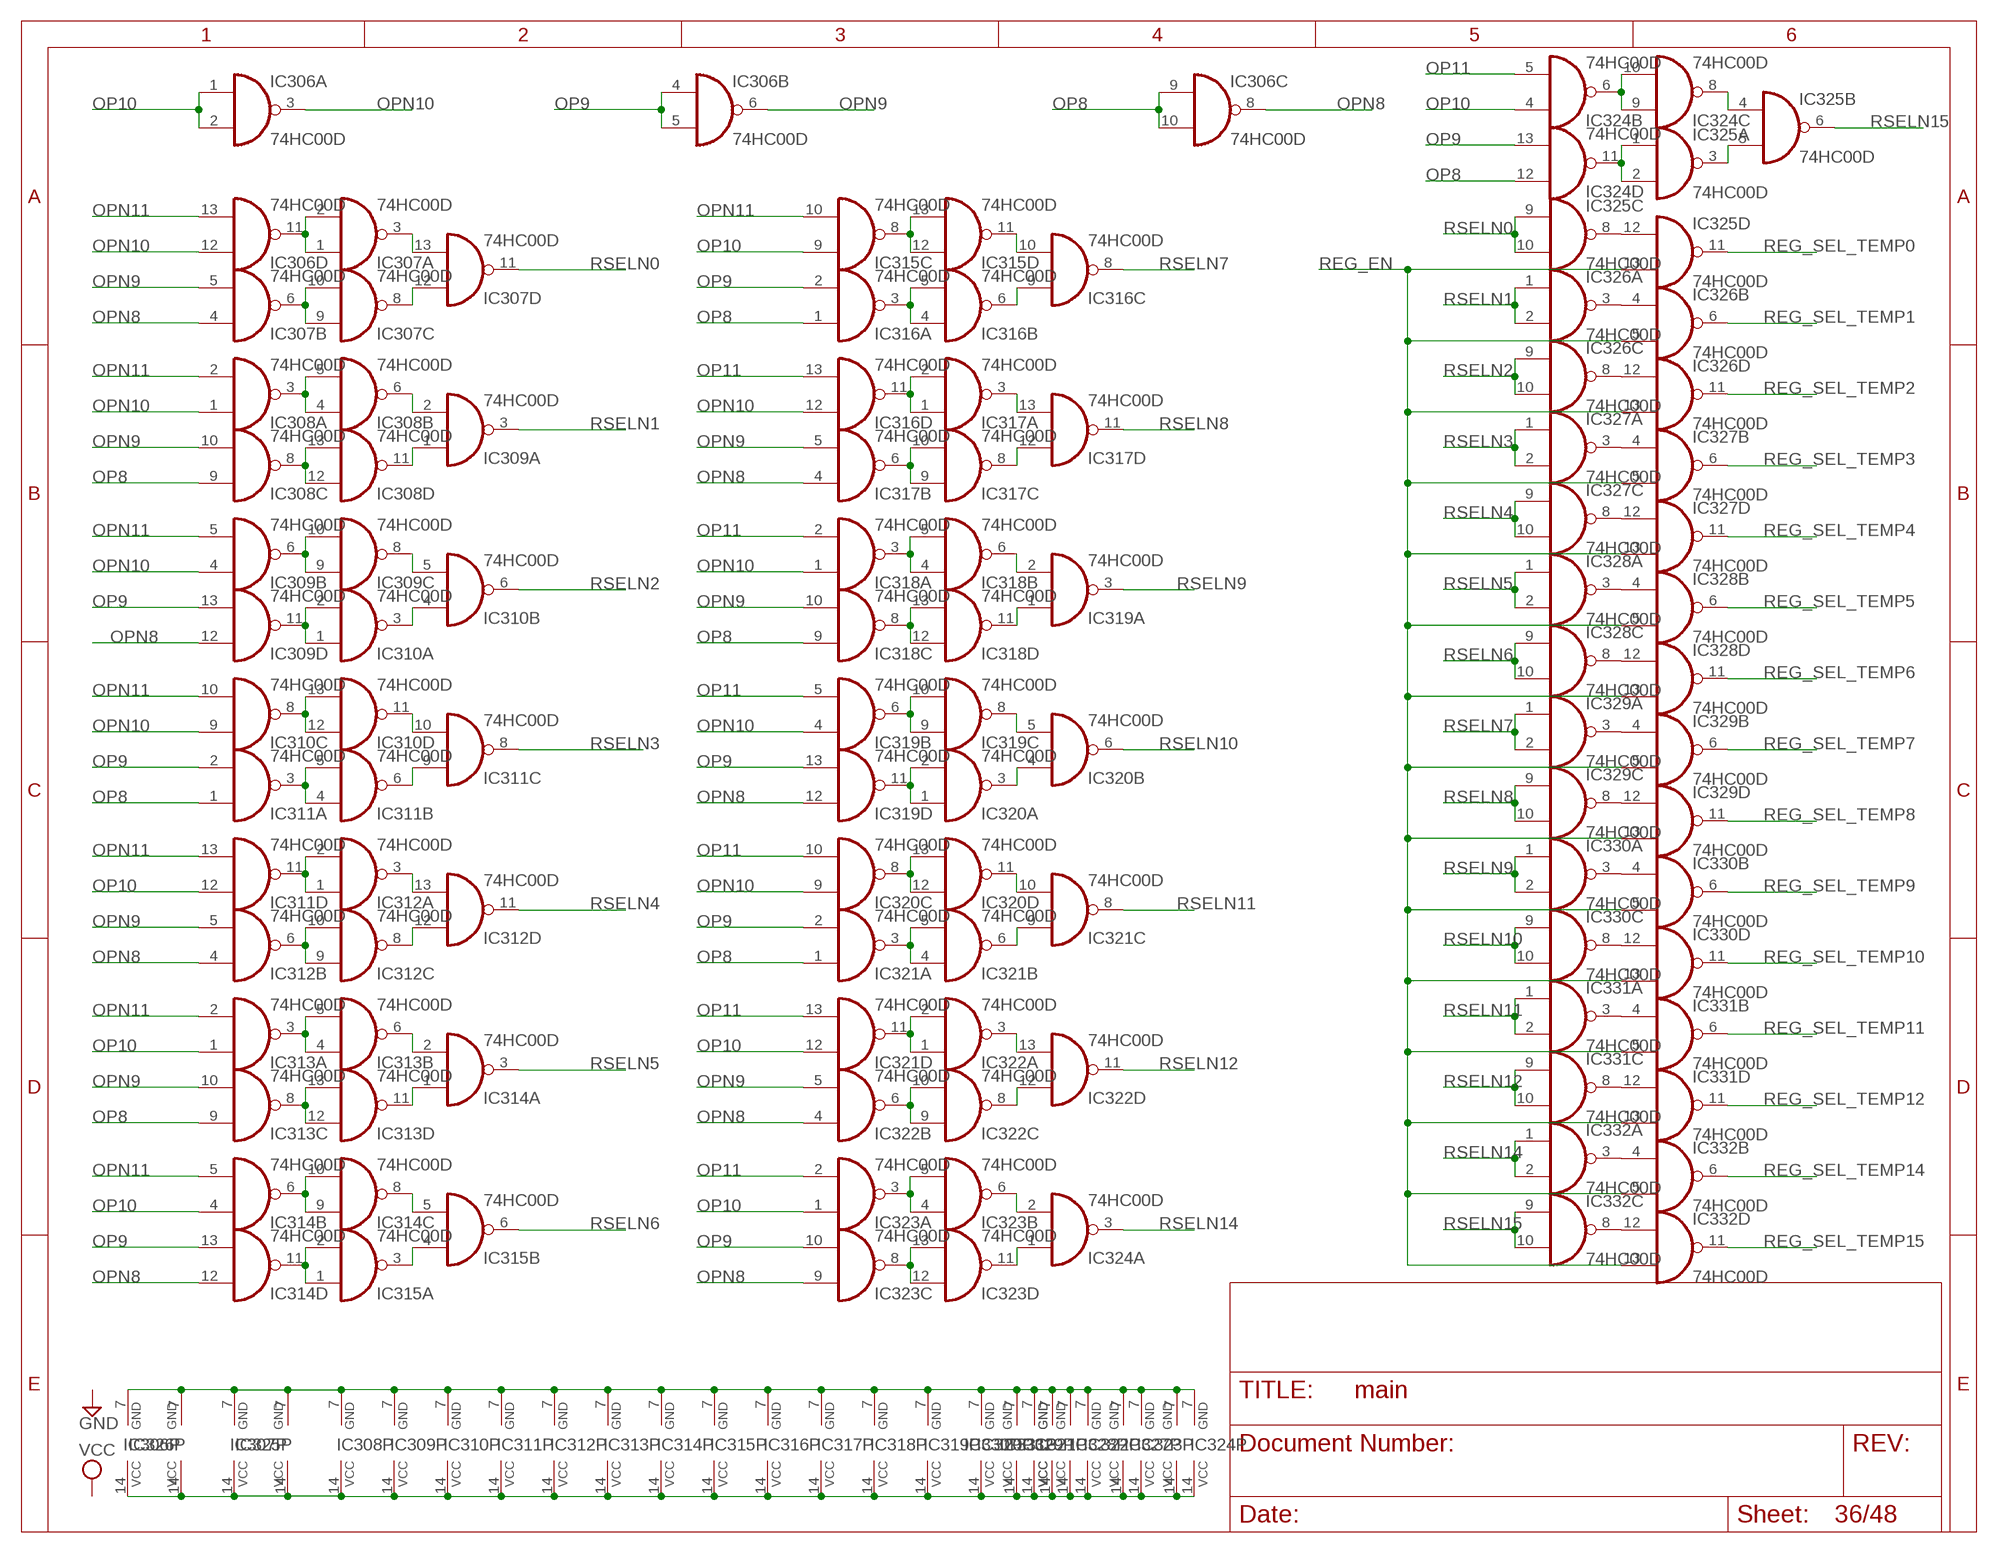
[diagram p34: schematic, sheet 36]

### Parts
IC306  74HC00D  [SO14]
IC307  74HC00D  [SO14]
IC308  74HC00D  [SO14]
IC309  74HC00D  [SO14]
IC310  74HC00D  [SO14]
IC311  74HC00D  [SO14]
IC312  74HC00D  [SO14]
IC313  74HC00D  [SO14]
IC314  74HC00D  [SO14]
IC315  74HC00D  [SO14]
IC316  74HC00D  [SO14]
IC317  74HC00D  [SO14]
IC318  74HC00D  [SO14]
IC319  74HC00D  [SO14]
IC320  74HC00D  [SO14]
IC321  74HC00D  [SO14]
IC322  74HC00D  [SO14]
IC323  74HC00D  [SO14]
IC324  74HC00D  [SO14]
IC325  74HC00D  [SO14]
IC326  74HC00D  [SO14]
IC327  74HC00D  [SO14]
IC328  74HC00D  [SO14]
IC329  74HC00D  [SO14]
IC330  74HC00D  [SO14]
IC331  74HC00D  [SO14]
IC332  74HC00D  [SO14]

### Nets
N$755: IC306.11(D:O) IC307.1(A:I0) IC307.2(A:I1)
N$798: IC307.6(B:O) IC307.9(C:I0) IC307.10(C:I1)
N$806: IC308.3(A:O) IC308.4(B:I0) IC308.5(B:I1)
N$807: IC308.8(C:O) IC308.12(D:I0) IC308.13(D:I1)
N$808: IC309.6(B:O) IC309.9(C:I0) IC309.10(C:I1)
N$810: IC309.11(D:O) IC310.1(A:I0) IC310.2(A:I1)
N$811: IC310.8(C:O) IC310.12(D:I0) IC310.13(D:I1)
N$812: IC311.3(A:O) IC311.4(B:I0) IC311.5(B:I1)
N$813: IC311.11(D:O) IC312.1(A:I0) IC312.2(A:I1)
N$819: IC312.6(B:O) IC312.9(C:I0) IC312.10(C:I1)
N$823: IC313.3(A:O) IC313.4(B:I0) IC313.5(B:I1)
N$824: IC314.6(B:O) IC314.9(C:I0) IC314.10(C:I1)
N$826: IC313.8(C:O) IC313.12(D:I0) IC313.13(D:I1)
N$828: IC314.11(D:O) IC315.1(A:I0) IC315.2(A:I1)
N$829: IC315.3(A:O) IC315.4(B:I0)
N$830: IC314.8(C:O) IC315.5(B:I1)
N$833: IC313.11(D:O) IC314.1(A:I0)
N$834: IC313.6(B:O) IC314.2(A:I1)
N$835: IC312.8(C:O) IC312.12(D:I0)
N$838: IC312.3(A:O) IC312.13(D:I1)
N$841: IC311.6(B:O) IC311.9(C:I0)
N$843: IC310.11(D:O) IC311.10(C:I1)
N$844: IC310.3(A:O) IC310.4(B:I0)
N$845: IC308.6(B:O) IC309.2(A:I1)
N$847: IC308.11(D:O) IC309.1(A:I0)
N$851: IC309.8(C:O) IC310.5(B:I1)
N$853: IC307.3(A:O) IC307.13(D:I1)
N$854: IC307.8(C:O) IC307.12(D:I0)
N$855: IC315.8(C:O) IC315.12(D:I0) IC315.13(D:I1)
N$858: IC316.3(A:O) IC316.4(B:I0) IC316.5(B:I1)
N$862: IC316.11(D:O) IC317.1(A:I0) IC317.2(A:I1)
N$863: IC317.6(B:O) IC317.9(C:I0) IC317.10(C:I1)
N$864: IC318.3(A:O) IC318.4(B:I0) IC318.5(B:I1)
N$867: IC318.8(C:O) IC318.12(D:I0) IC318.13(D:I1)
N$873: IC319.6(B:O) IC319.9(C:I0) IC319.10(C:I1)
N$876: IC319.11(D:O) IC320.1(A:I0) IC320.2(A:I1)
N$877: IC320.8(C:O) IC320.12(D:I0) IC320.13(D:I1)
N$878: IC321.3(A:O) IC321.4(B:I0) IC321.5(B:I1)
N$880: IC321.11(D:O) IC322.1(A:I0) IC322.2(A:I1)
N$885: IC322.6(B:O) IC322.9(C:I0) IC322.10(C:I1)
N$886: IC323.3(A:O) IC323.4(B:I0) IC323.5(B:I1)
N$887: IC323.8(C:O) IC323.12(D:I0) IC323.13(D:I1)
N$888: IC323.11(D:O) IC324.1(A:I0)
N$889: IC323.6(B:O) IC324.2(A:I1)
N$893: IC322.8(C:O) IC322.12(D:I0)
N$895: IC322.3(A:O) IC322.13(D:I1)
N$896: IC321.6(B:O) IC321.9(C:I0)
N$897: IC320.11(D:O) IC321.10(C:I1)
N$898: IC320.3(A:O) IC320.4(B:I0)
N$899: IC319.8(C:O) IC320.5(B:I1)
N$900: IC318.11(D:O) IC319.1(A:I0)
N$901: IC318.6(B:O) IC319.2(A:I1)
N$904: IC317.8(C:O) IC317.12(D:I0)
N$905: IC317.3(A:O) IC317.13(D:I1)
N$906: IC316.6(B:O) IC316.9(C:I0)
N$907: IC315.11(D:O) IC316.10(C:I1)
N$908: IC325.8(C:O) IC325.12(D:I0)
N$913: IC326.3(A:O) IC326.4(B:I0)
N$914: IC326.8(C:O) IC326.12(D:I0)
N$915: IC328.3(A:O) IC328.4(B:I0)
N$916: IC306.14(P:VCC) IC307.14(P:VCC) IC308.14(P:VCC) IC309.14(P:VCC) IC310.14(P:VCC) IC311.14(P:VCC) IC312.14(P:VCC) IC313.14(P:VCC) IC314.14(P:VCC) IC315.14(P:VCC) IC316.14(P:VCC) IC317.14(P:VCC) IC318.14(P:VCC) IC319.14(P:VCC) IC320.14(P:VCC) IC321.14(P:VCC) IC322.14(P:VCC) IC323.14(P:VCC) IC324.14(P:VCC) IC325.14(P:VCC) IC326.14(P:VCC) IC327.14(P:VCC) IC328.14(P:VCC) IC329.14(P:VCC) IC330.14(P:VCC) IC331.14(P:VCC)
N$922: IC324.6(B:O) IC324.9(C:I0) IC324.10(C:I1)
N$923: IC324.11(D:O) IC325.1(A:I0) IC325.2(A:I1)
N$924: IC324.8(C:O) IC325.4(B:I0)
N$925: IC325.3(A:O) IC325.5(B:I1)
N$929: IC327.3(A:O) IC327.4(B:I0)
N$930: IC327.8(C:O) IC327.12(D:I0)
N$931: IC306.7(P:GND) IC307.7(P:GND) IC308.7(P:GND) IC309.7(P:GND) IC310.7(P:GND) IC311.7(P:GND) IC312.7(P:GND) IC313.7(P:GND) IC314.7(P:GND) IC315.7(P:GND) IC316.7(P:GND) IC317.7(P:GND) IC318.7(P:GND) IC319.7(P:GND) IC320.7(P:GND) IC321.7(P:GND) IC322.7(P:GND) IC323.7(P:GND) IC324.7(P:GND) IC325.7(P:GND) IC326.7(P:GND) IC327.7(P:GND) IC328.7(P:GND) IC329.7(P:GND) IC330.7(P:GND) IC331.7(P:GND)
N$932: IC328.8(C:O) IC328.12(D:I0)
N$949: IC329.3(A:O) IC329.4(B:I0)
N$950: IC329.8(C:O) IC329.12(D:I0)
N$951: IC330.3(A:O) IC330.4(B:I0)
N$952: IC330.8(C:O) IC330.12(D:I0)
N$953: IC331.3(A:O) IC331.4(B:I0)
N$954: IC331.8(C:O) IC331.12(D:I0)
N$955: IC332.3(A:O) IC332.4(B:I0)
N$956: IC332.8(C:O) IC332.12(D:I0)
OP8: IC306.9(C:I0) IC306.10(C:I1) IC308.9(C:I0) IC311.1(A:I0) IC313.9(C:I0) IC316.1(A:I0) IC318.9(C:I0) IC321.1(A:I0) IC324.12(D:I0) ; also sheet 47
OP9: IC306.4(B:I0) IC306.5(B:I1) IC309.13(D:I1) IC311.2(A:I1) IC314.13(D:I1) IC316.2(A:I1) IC319.13(D:I1) IC321.2(A:I1) IC323.10(C:I1) IC324.13(D:I1) ; also sheet 47
OP10: IC306.1(A:I0) IC306.2(A:I1) IC311.12(D:I0) IC313.1(A:I0) IC314.4(B:I0) IC315.9(C:I0) IC321.12(D:I0) IC323.1(A:I0) IC324.4(B:I0) ; also sheet 47
OP11: IC316.13(D:I1) IC318.2(A:I1) IC319.5(B:I1) IC320.10(C:I1) IC321.13(D:I1) IC323.2(A:I1) IC324.5(B:I1) ; also sheet 34,47
OPN8: IC306.8(C:O) IC307.4(B:I0) IC309.12(D:I0) IC312.4(B:I0) IC314.12(D:I0) IC317.4(B:I0) IC319.12(D:I0) IC322.4(B:I0) IC323.9(C:I0)
OPN9: IC306.6(B:O) IC307.5(B:I1) IC308.10(C:I1) IC312.5(B:I1) IC313.10(C:I1) IC317.5(B:I1) IC318.10(C:I1) IC322.5(B:I1)
OPN10: IC306.3(A:O) IC306.12(D:I0) IC308.1(A:I0) IC309.4(B:I0) IC310.9(C:I0) IC316.12(D:I0) IC318.1(A:I0) IC319.4(B:I0) IC320.9(C:I0)
OPN11: IC306.13(D:I1) IC308.2(A:I1) IC309.5(B:I1) IC310.10(C:I1) IC311.13(D:I1) IC313.2(A:I1) IC314.5(B:I1) IC315.10(C:I1) ; also sheet 34
REG_EN: IC325.13(D:I1) IC326.5(B:I1) IC326.13(D:I1) IC327.5(B:I1) IC327.13(D:I1) IC328.5(B:I1) IC328.13(D:I1) IC329.5(B:I1) IC329.13(D:I1) IC330.5(B:I1) IC330.13(D:I1) IC331.5(B:I1) IC331.13(D:I1) IC332.5(B:I1) IC332.13(D:I1) ; also sheet 46
REG_SEL_TEMP0: IC325.11(D:O)
REG_SEL_TEMP1: IC326.6(B:O)
REG_SEL_TEMP2: IC326.11(D:O)
REG_SEL_TEMP3: IC327.6(B:O)
REG_SEL_TEMP4: IC327.11(D:O)
REG_SEL_TEMP5: IC328.6(B:O)
REG_SEL_TEMP6: IC328.11(D:O)
REG_SEL_TEMP7: IC329.6(B:O)
REG_SEL_TEMP8: IC329.11(D:O)
REG_SEL_TEMP9: IC330.6(B:O)
REG_SEL_TEMP10: IC330.11(D:O)
REG_SEL_TEMP11: IC331.6(B:O)
REG_SEL_TEMP12: IC331.11(D:O)
REG_SEL_TEMP14: IC332.6(B:O)
REG_SEL_TEMP15: IC332.11(D:O)
RSELN0: IC307.11(D:O) IC325.9(C:I0) IC325.10(C:I1)
RSELN1: IC309.3(A:O) IC326.1(A:I0) IC326.2(A:I1)
RSELN2: IC310.6(B:O) IC326.9(C:I0) IC326.10(C:I1)
RSELN3: IC311.8(C:O) IC327.1(A:I0) IC327.2(A:I1)
RSELN4: IC312.11(D:O) IC327.9(C:I0) IC327.10(C:I1)
RSELN5: IC314.3(A:O) IC328.1(A:I0) IC328.2(A:I1)
RSELN6: IC315.6(B:O) IC328.9(C:I0) IC328.10(C:I1)
RSELN7: IC316.8(C:O) IC329.1(A:I0) IC329.2(A:I1)
RSELN8: IC317.11(D:O) IC329.9(C:I0) IC329.10(C:I1)
RSELN9: IC319.3(A:O) IC330.1(A:I0) IC330.2(A:I1)
RSELN10: IC320.6(B:O) IC330.9(C:I0) IC330.10(C:I1)
RSELN11: IC321.8(C:O) IC331.1(A:I0) IC331.2(A:I1)
RSELN12: IC322.11(D:O) IC331.9(C:I0) IC331.10(C:I1)
RSELN14: IC324.3(A:O) IC332.1(A:I0) IC332.2(A:I1)
RSELN15: IC325.6(B:O) IC332.9(C:I0) IC332.10(C:I1) ; also sheet 46

## Sheet 37 of 48: OP_SELECT
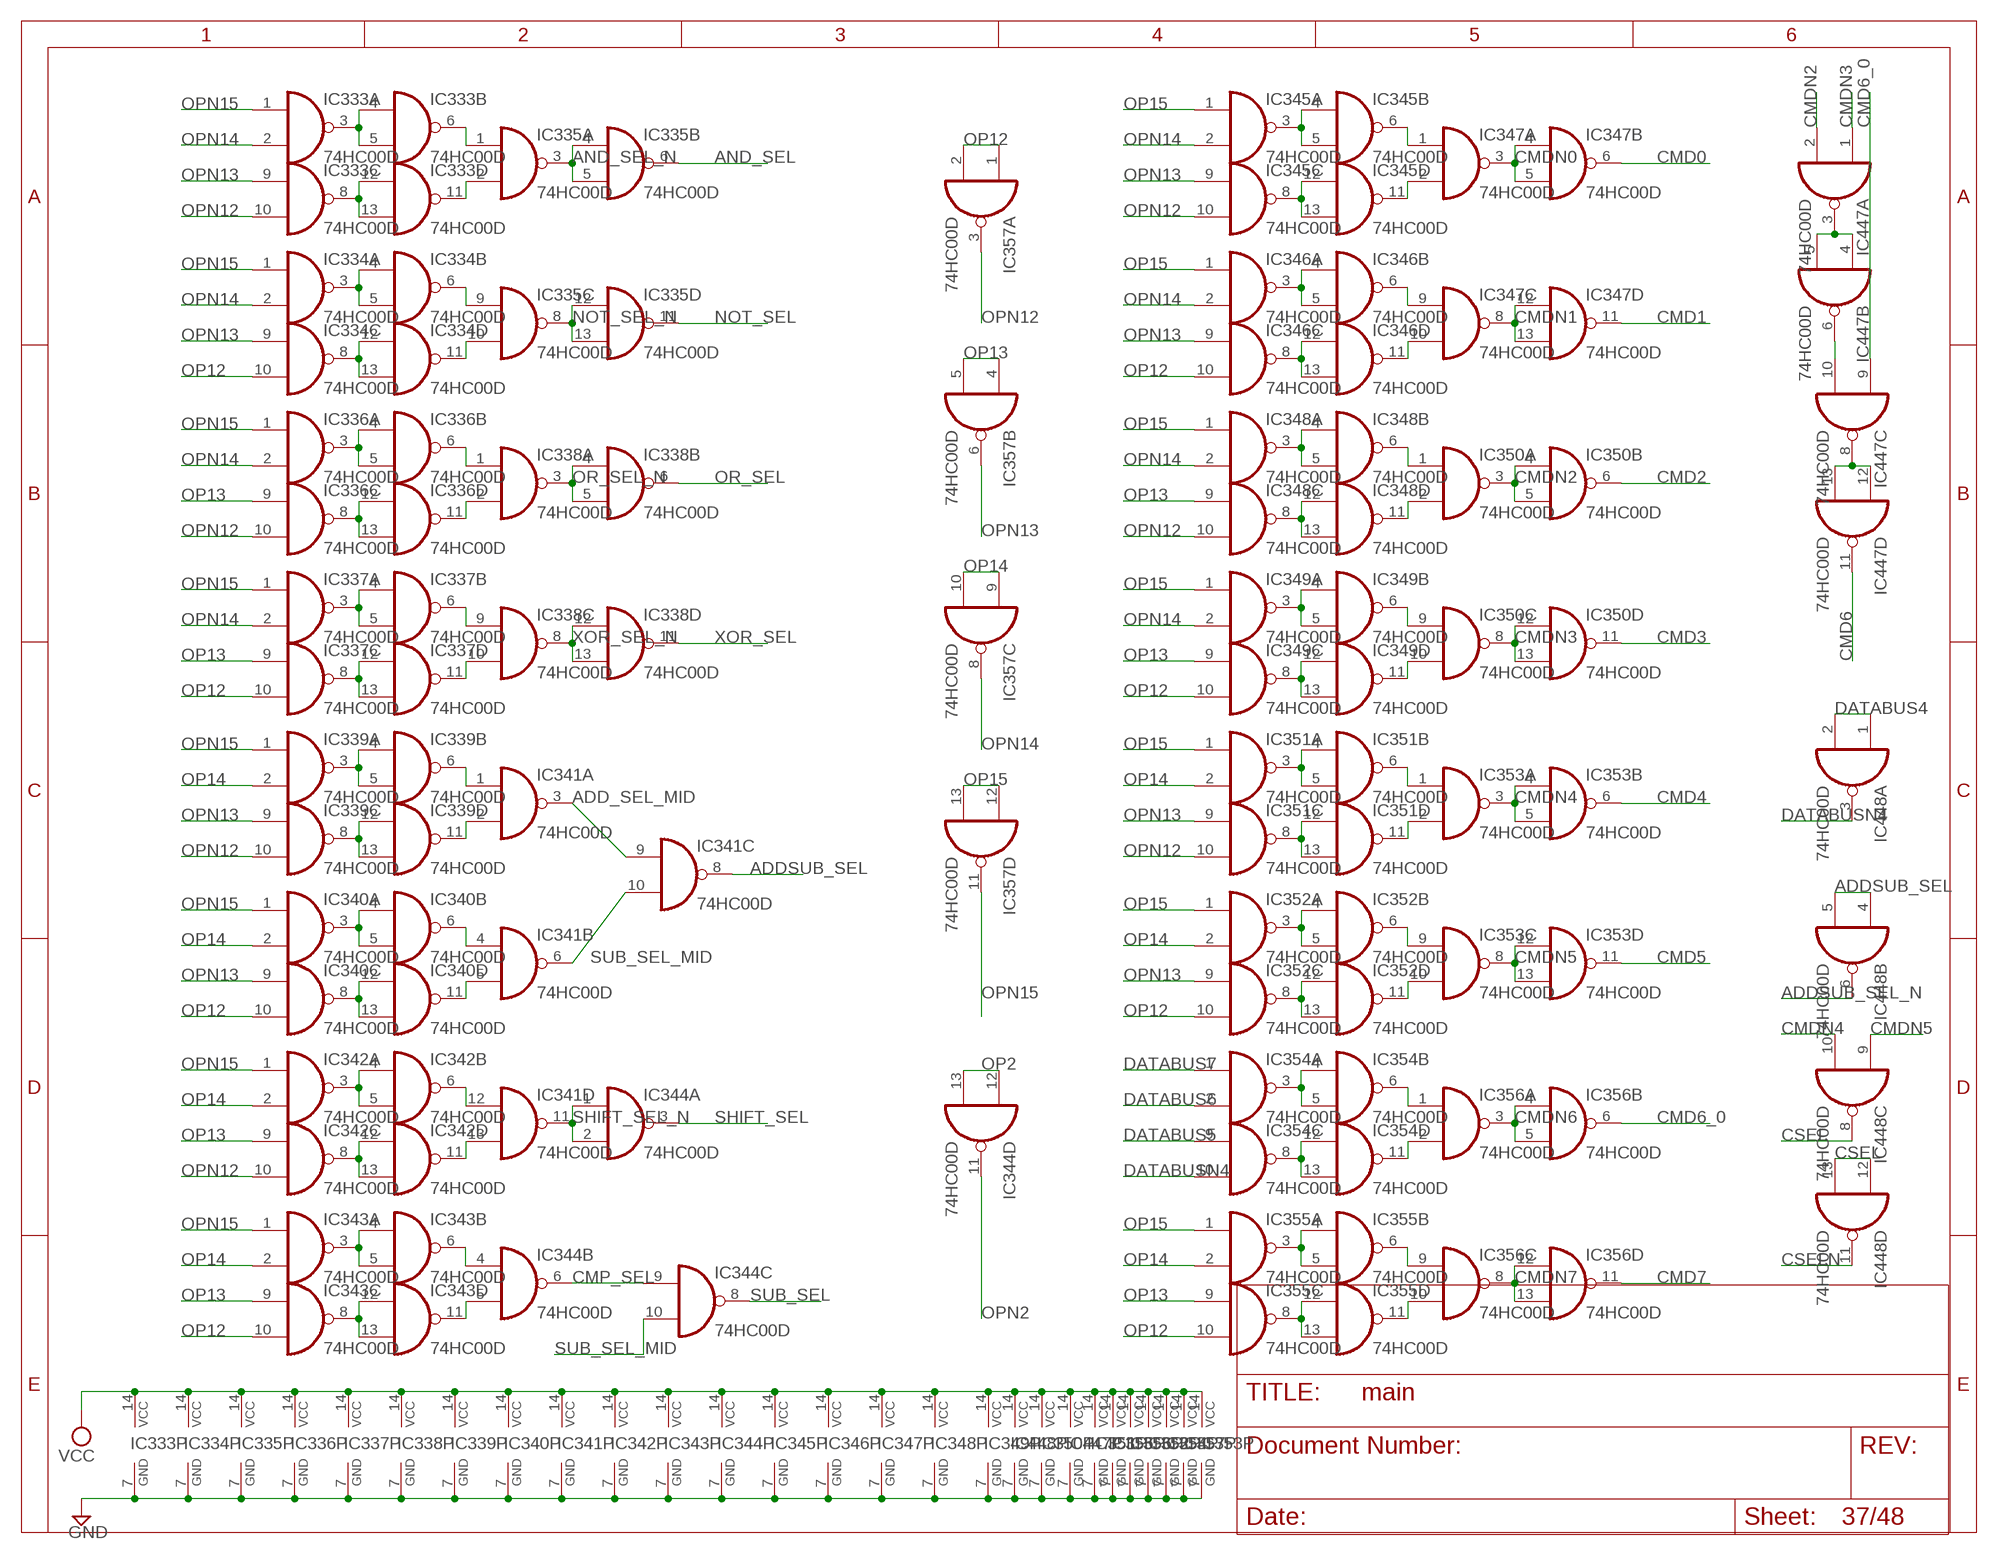
[diagram p35: schematic, sheet 37]

### Parts
IC333  74HC00D  [SO14]
IC334  74HC00D  [SO14]
IC335  74HC00D  [SO14]
IC336  74HC00D  [SO14]
IC337  74HC00D  [SO14]
IC338  74HC00D  [SO14]
IC339  74HC00D  [SO14]
IC340  74HC00D  [SO14]
IC341  74HC00D  [SO14]
IC342  74HC00D  [SO14]
IC343  74HC00D  [SO14]
IC344  74HC00D  [SO14]
IC345  74HC00D  [SO14]
IC346  74HC00D  [SO14]
IC347  74HC00D  [SO14]
IC348  74HC00D  [SO14]
IC349  74HC00D  [SO14]
IC350  74HC00D  [SO14]
IC351  74HC00D  [SO14]
IC352  74HC00D  [SO14]
IC353  74HC00D  [SO14]
IC354  74HC00D  [SO14]
IC355  74HC00D  [SO14]
IC356  74HC00D  [SO14]
IC357  74HC00D  [SO14]
IC447  74HC00D  [SO14]
IC448  74HC00D  [SO14]

### Nets
ADDSUB_SEL: IC341.8(C:O) IC448.4(B:I0) IC448.5(B:I1)
ADDSUB_SEL_N: IC448.6(B:O) ; also sheet 46
AND_SEL: IC335.6(B:O)
AND_SEL_N: IC335.3(A:O) IC335.4(B:I0) IC335.5(B:I1) ; also sheet 44,45,46
CMD0: IC347.6(B:O) ; also sheet 34
CMD1: IC347.11(D:O) ; also sheet 46
CMD2: IC350.6(B:O)
CMD3: IC350.11(D:O)
CMD4: IC353.6(B:O)
CMD5: IC353.11(D:O)
CMD6: IC447.11(D:O) ; also sheet 46
CMD6_0: IC356.6(B:O) IC447.9(C:I0)
CMD7: IC356.11(D:O)
CMDN0: IC347.3(A:O) IC347.4(B:I0) IC347.5(B:I1) ; also sheet 44,45,46
CMDN1: IC347.8(C:O) IC347.12(D:I0) IC347.13(D:I1)
CMDN2: IC350.3(A:O) IC350.4(B:I0) IC350.5(B:I1) IC447.2(A:I1) ; also sheet 34,46,47
CMDN3: IC350.8(C:O) IC350.12(D:I0) IC350.13(D:I1) IC447.1(A:I0) ; also sheet 34,47
CMDN4: IC353.3(A:O) IC353.4(B:I0) IC353.5(B:I1) IC448.10(C:I1)
CMDN5: IC353.8(C:O) IC353.12(D:I0) IC353.13(D:I1) IC448.9(C:I0)
CMDN6: IC356.3(A:O) IC356.4(B:I0) IC356.5(B:I1)
CMDN7: IC356.8(C:O) IC356.12(D:I0) IC356.13(D:I1) ; also sheet 44,45,46
CMP_SEL: IC344.6(B:O) IC344.9(C:I0)
CSEL: IC448.8(C:O) IC448.12(D:I0) IC448.13(D:I1) ; also sheet 26
CSELN: IC448.11(D:O) ; also sheet 46
DATABUS4: IC448.1(A:I0) IC448.2(A:I1)
DATABUS5: IC354.9(C:I0)
DATABUS6: IC354.2(A:I1)
DATABUS7: IC354.1(A:I0)
DATABUSN4: IC354.10(C:I1) IC448.3(A:O)
GND: IC333.7(P:GND) IC334.7(P:GND) IC335.7(P:GND) IC336.7(P:GND) IC337.7(P:GND) IC338.7(P:GND) IC339.7(P:GND) IC340.7(P:GND) IC341.7(P:GND) IC342.7(P:GND) IC343.7(P:GND) IC344.7(P:GND) IC345.7(P:GND) IC346.7(P:GND) IC347.7(P:GND) IC348.7(P:GND) IC349.7(P:GND) IC350.7(P:GND) IC351.7(P:GND) IC352.7(P:GND) IC353.7(P:GND) IC354.7(P:GND) IC355.7(P:GND) IC356.7(P:GND) IC357.7(P:GND) IC447.7(P:GND) IC448.7(P:GND) ; also sheet 1,2,3,4,5,6,7,8,9,10,11,12,13,14,15,16,17,18,19,20,21,22,23,24,25,26,27,28,29,30,31,32,33,34,38,39,40,41,42,43,44,45,46,47
N$909: IC333.3(A:O) IC333.4(B:I0) IC333.5(B:I1)
N$910: IC333.8(C:O) IC333.12(D:I0) IC333.13(D:I1)
N$911: IC333.6(B:O) IC335.1(A:I0)
N$912: IC333.11(D:O) IC335.2(A:I1)
N$918: IC334.6(B:O) IC335.9(C:I0)
N$919: IC334.11(D:O) IC335.10(C:I1)
N$920: IC336.6(B:O) IC338.1(A:I0)
N$921: IC336.11(D:O) IC338.2(A:I1)
N$926: IC336.8(C:O) IC336.12(D:I0) IC336.13(D:I1)
N$927: IC336.3(A:O) IC336.4(B:I0) IC336.5(B:I1)
N$928: IC334.3(A:O) IC334.4(B:I0) IC334.5(B:I1)
N$933: IC334.8(C:O) IC334.12(D:I0) IC334.13(D:I1)
N$934: IC337.3(A:O) IC337.4(B:I0) IC337.5(B:I1)
N$935: IC337.8(C:O) IC337.12(D:I0) IC337.13(D:I1)
N$936: IC337.6(B:O) IC338.9(C:I0)
N$937: IC337.11(D:O) IC338.10(C:I1)
N$938: IC339.6(B:O) IC341.1(A:I0)
N$939: IC339.11(D:O) IC341.2(A:I1)
N$940: IC339.3(A:O) IC339.4(B:I0) IC339.5(B:I1)
N$941: IC339.8(C:O) IC339.12(D:I0) IC339.13(D:I1)
N$942: IC340.3(A:O) IC340.4(B:I0) IC340.5(B:I1)
N$943: IC340.8(C:O) IC340.12(D:I0) IC340.13(D:I1)
N$944: IC340.11(D:O) IC341.5(B:I1)
N$945: IC340.6(B:O) IC341.4(B:I0)
N$946: IC341.12(D:I0) IC342.6(B:O)
N$947: IC341.13(D:I1) IC342.11(D:O)
N$948: IC342.3(A:O) IC342.4(B:I0) IC342.5(B:I1)
N$957: IC342.8(C:O) IC342.12(D:I0) IC342.13(D:I1)
N$958: IC343.3(A:O) IC343.4(B:I0) IC343.5(B:I1)
N$959: IC343.8(C:O) IC343.12(D:I0) IC343.13(D:I1)
N$960: IC343.11(D:O) IC344.5(B:I1)
N$961: IC343.6(B:O) IC344.4(B:I0)
N$969: IC345.3(A:O) IC345.4(B:I0) IC345.5(B:I1)
N$970: IC345.8(C:O) IC345.12(D:I0) IC345.13(D:I1)
N$971: IC346.3(A:O) IC346.4(B:I0) IC346.5(B:I1)
N$972: IC346.8(C:O) IC346.12(D:I0) IC346.13(D:I1)
N$973: IC346.11(D:O) IC347.10(C:I1)
N$974: IC346.6(B:O) IC347.9(C:I0)
N$975: IC345.11(D:O) IC347.2(A:I1)
N$976: IC345.6(B:O) IC347.1(A:I0)
N$977: IC348.3(A:O) IC348.4(B:I0) IC348.5(B:I1)
N$978: IC348.8(C:O) IC348.12(D:I0) IC348.13(D:I1)
N$979: IC348.6(B:O) IC350.1(A:I0)
N$980: IC348.11(D:O) IC350.2(A:I1)
N$989: IC355.11(D:O) IC356.10(C:I1)
N$990: IC355.6(B:O) IC356.9(C:I0)
N$991: IC354.11(D:O) IC356.2(A:I1)
N$992: IC354.6(B:O) IC356.1(A:I0)
N$993: IC352.11(D:O) IC353.10(C:I1)
N$994: IC352.6(B:O) IC353.9(C:I0)
N$995: IC351.11(D:O) IC353.2(A:I1)
N$996: IC351.6(B:O) IC353.1(A:I0)
N$997: IC349.11(D:O) IC350.10(C:I1)
N$998: IC349.6(B:O) IC350.9(C:I0)
N$999: IC355.8(C:O) IC355.12(D:I0) IC355.13(D:I1)
N$1000: IC355.3(A:O) IC355.4(B:I0) IC355.5(B:I1)
N$1001: IC354.8(C:O) IC354.12(D:I0) IC354.13(D:I1)
N$1002: IC354.3(A:O) IC354.4(B:I0) IC354.5(B:I1)
N$1003: IC352.3(A:O) IC352.4(B:I0) IC352.5(B:I1)
N$1004: IC352.8(C:O) IC352.12(D:I0) IC352.13(D:I1)
N$1005: IC351.3(A:O) IC351.4(B:I0) IC351.5(B:I1)
N$1006: IC351.8(C:O) IC351.12(D:I0) IC351.13(D:I1)
N$1007: IC349.8(C:O) IC349.12(D:I0) IC349.13(D:I1)
N$1008: IC349.3(A:O) IC349.4(B:I0) IC349.5(B:I1)
N$1029: IC447.3(A:O) IC447.4(B:I0) IC447.5(B:I1)
N$1030: IC447.6(B:O) IC447.10(C:I1)
N$1032: IC447.8(C:O) IC447.12(D:I0) IC447.13(D:I1)
NOT_SEL: IC335.11(D:O)
NOT_SEL_N: IC335.8(C:O) IC335.12(D:I0) IC335.13(D:I1) ; also sheet 44,45,46
OP2: IC344.12(D:I0) IC344.13(D:I1) ; also sheet 29,30,39,45,46,47
OP12: IC334.10(C:I1) IC337.10(C:I1) IC340.10(C:I1) IC343.10(C:I1) IC346.10(C:I1) IC349.10(C:I1) IC352.10(C:I1) IC355.10(C:I1) IC357.1(A:I0) IC357.2(A:I1)
OP13: IC336.9(C:I0) IC337.9(C:I0) IC342.9(C:I0) IC343.9(C:I0) IC348.9(C:I0) IC349.9(C:I0) IC355.9(C:I0) IC357.4(B:I0) IC357.5(B:I1)
OP14: IC339.2(A:I1) IC340.2(A:I1) IC342.2(A:I1) IC343.2(A:I1) IC351.2(A:I1) IC352.2(A:I1) IC355.2(A:I1) IC357.9(C:I0) IC357.10(C:I1)
OP15: IC345.1(A:I0) IC346.1(A:I0) IC348.1(A:I0) IC349.1(A:I0) IC351.1(A:I0) IC352.1(A:I0) IC355.1(A:I0) IC357.12(D:I0) IC357.13(D:I1)
OPN2: IC344.11(D:O) ; also sheet 30,39,46
OPN12: IC333.10(C:I1) IC336.10(C:I1) IC339.10(C:I1) IC342.10(C:I1) IC345.10(C:I1) IC348.10(C:I1) IC351.10(C:I1) IC357.3(A:O)
OPN13: IC333.9(C:I0) IC334.9(C:I0) IC339.9(C:I0) IC340.9(C:I0) IC345.9(C:I0) IC346.9(C:I0) IC351.9(C:I0) IC352.9(C:I0) IC357.6(B:O)
OPN14: IC333.2(A:I1) IC334.2(A:I1) IC336.2(A:I1) IC337.2(A:I1) IC345.2(A:I1) IC346.2(A:I1) IC348.2(A:I1) IC349.2(A:I1) IC357.8(C:O)
OPN15: IC333.1(A:I0) IC334.1(A:I0) IC336.1(A:I0) IC337.1(A:I0) IC339.1(A:I0) IC340.1(A:I0) IC342.1(A:I0) IC343.1(A:I0) IC357.11(D:O)
OR_SEL: IC338.6(B:O)
OR_SEL_N: IC338.3(A:O) IC338.4(B:I0) IC338.5(B:I1) ; also sheet 44,45,46
SHIFT_SEL: IC344.3(A:O)
SHIFT_SEL_N: IC341.11(D:O) IC344.1(A:I0) IC344.2(A:I1) ; also sheet 44,45,46
SUB_SEL: IC344.8(C:O) ; also sheet 26,27
SUB_SEL_MID: IC344.10(C:I1)
VCC: IC333.14(P:VCC) IC334.14(P:VCC) IC335.14(P:VCC) IC336.14(P:VCC) IC337.14(P:VCC) IC338.14(P:VCC) IC339.14(P:VCC) IC340.14(P:VCC) IC341.14(P:VCC) IC342.14(P:VCC) IC343.14(P:VCC) IC344.14(P:VCC) IC345.14(P:VCC) IC346.14(P:VCC) IC347.14(P:VCC) IC348.14(P:VCC) IC349.14(P:VCC) IC350.14(P:VCC) IC351.14(P:VCC) IC352.14(P:VCC) IC353.14(P:VCC) IC354.14(P:VCC) IC355.14(P:VCC) IC356.14(P:VCC) IC357.14(P:VCC) IC447.14(P:VCC) IC448.14(P:VCC) ; also sheet 1,2,3,4,5,6,7,8,9,10,11,12,13,14,15,16,17,18,19,20,21,22,23,24,25,26,27,28,29,30,31,32,33,34,38,39,40,41,42,43,44,45,46,47
XOR_SEL: IC338.11(D:O)
XOR_SEL_N: IC338.8(C:O) IC338.12(D:I0) IC338.13(D:I1) ; also sheet 44,45,46
Unconnected: IC341.3(A:O) IC341.6(B:O) IC341.9(C:I0) IC341.10(C:I1)

## Sheet 38 of 48: rsela
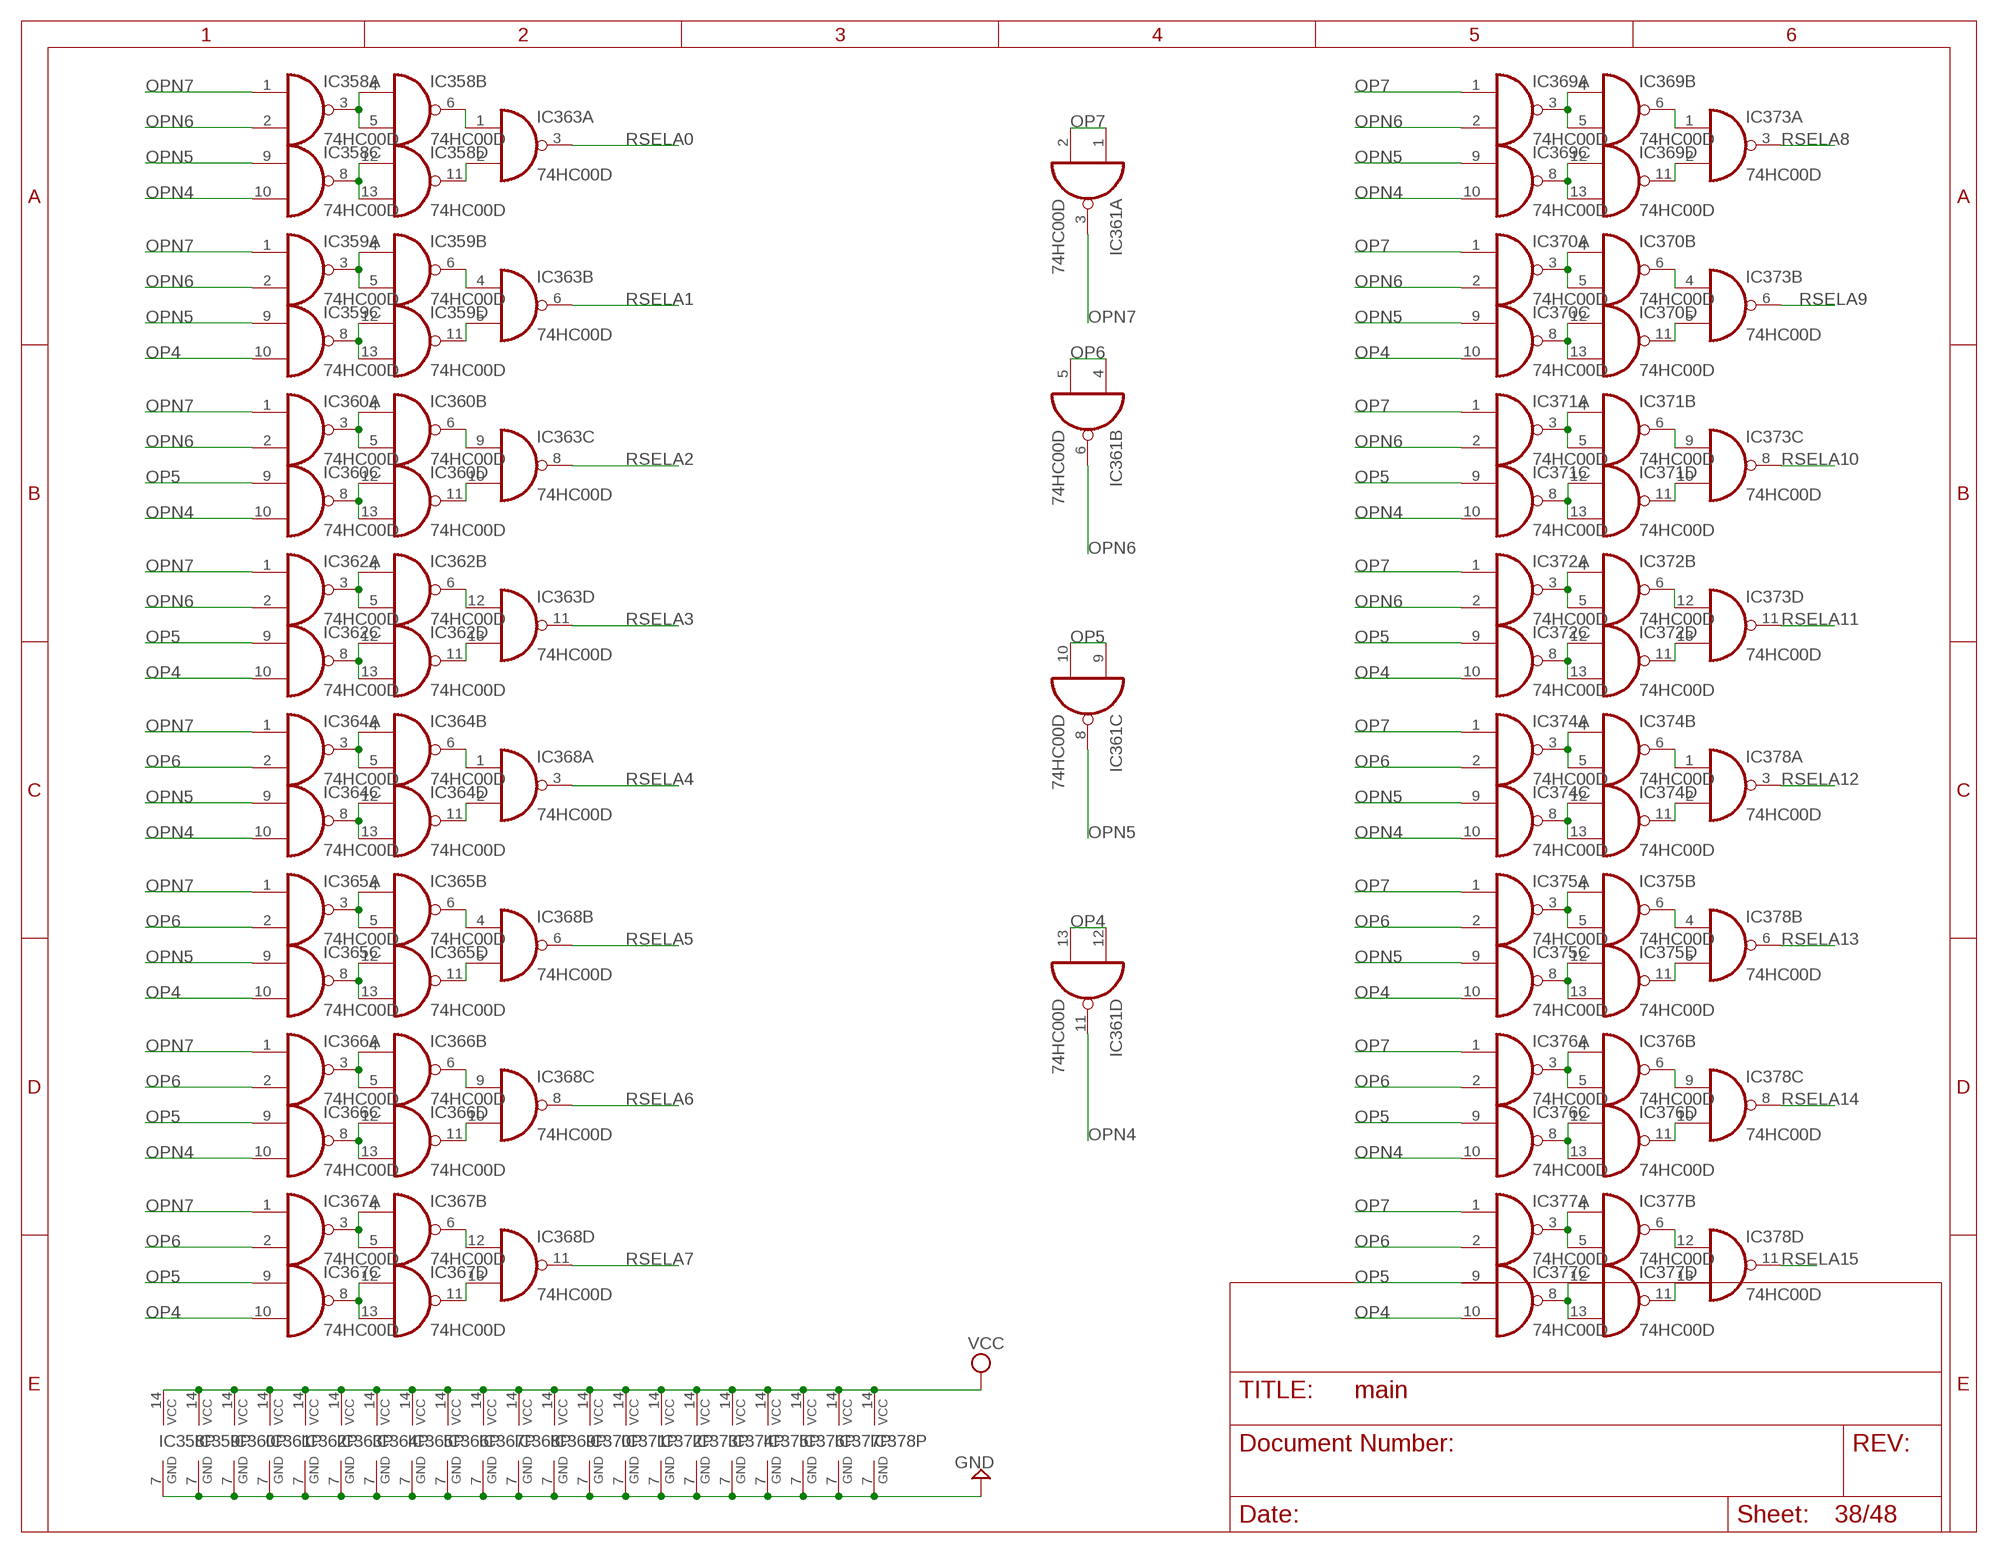
[diagram p36: schematic, sheet 38]

### Parts
IC358  74HC00D  [SO14]
IC359  74HC00D  [SO14]
IC360  74HC00D  [SO14]
IC361  74HC00D  [SO14]
IC362  74HC00D  [SO14]
IC363  74HC00D  [SO14]
IC364  74HC00D  [SO14]
IC365  74HC00D  [SO14]
IC366  74HC00D  [SO14]
IC367  74HC00D  [SO14]
IC368  74HC00D  [SO14]
IC369  74HC00D  [SO14]
IC370  74HC00D  [SO14]
IC371  74HC00D  [SO14]
IC372  74HC00D  [SO14]
IC373  74HC00D  [SO14]
IC374  74HC00D  [SO14]
IC375  74HC00D  [SO14]
IC376  74HC00D  [SO14]
IC377  74HC00D  [SO14]
IC378  74HC00D  [SO14]

### Nets
GND: IC358.7(P:GND) IC359.7(P:GND) IC360.7(P:GND) IC361.7(P:GND) IC362.7(P:GND) IC363.7(P:GND) IC364.7(P:GND) IC365.7(P:GND) IC366.7(P:GND) IC367.7(P:GND) IC368.7(P:GND) IC369.7(P:GND) IC370.7(P:GND) IC371.7(P:GND) IC372.7(P:GND) IC373.7(P:GND) IC374.7(P:GND) IC375.7(P:GND) IC376.7(P:GND) IC377.7(P:GND) IC378.7(P:GND) ; also sheet 1,2,3,4,5,6,7,8,9,10,11,12,13,14,15,16,17,18,19,20,21,22,23,24,25,26,27,28,29,30,31,32,33,34,37,39,40,41,42,43,44,45,46,47
N$658: IC377.6(B:O) IC378.12(D:I0)
N$659: IC377.11(D:O) IC378.13(D:I1)
N$660: IC377.8(C:O) IC377.12(D:I0) IC377.13(D:I1)
N$673: IC377.3(A:O) IC377.4(B:I0) IC377.5(B:I1)
N$675: IC376.8(C:O) IC376.12(D:I0) IC376.13(D:I1)
N$677: IC376.3(A:O) IC376.4(B:I0) IC376.5(B:I1)
N$679: IC375.8(C:O) IC375.12(D:I0) IC375.13(D:I1)
N$962: IC375.3(A:O) IC375.4(B:I0) IC375.5(B:I1)
N$964: IC374.8(C:O) IC374.12(D:I0) IC374.13(D:I1)
N$984: IC374.3(A:O) IC374.4(B:I0) IC374.5(B:I1)
N$985: IC372.8(C:O) IC372.12(D:I0) IC372.13(D:I1)
N$986: IC372.3(A:O) IC372.4(B:I0) IC372.5(B:I1)
N$987: IC371.8(C:O) IC371.12(D:I0) IC371.13(D:I1)
N$988: IC371.3(A:O) IC371.4(B:I0) IC371.5(B:I1)
N$1009: IC370.8(C:O) IC370.12(D:I0) IC370.13(D:I1)
N$1010: IC370.3(A:O) IC370.4(B:I0) IC370.5(B:I1)
N$1011: IC369.8(C:O) IC369.12(D:I0) IC369.13(D:I1)
N$1012: IC369.3(A:O) IC369.4(B:I0) IC369.5(B:I1)
N$1013: IC369.6(B:O) IC373.1(A:I0)
N$1014: IC369.11(D:O) IC373.2(A:I1)
N$1015: IC370.6(B:O) IC373.4(B:I0)
N$1016: IC370.11(D:O) IC373.5(B:I1)
N$1017: IC371.6(B:O) IC373.9(C:I0)
N$1018: IC371.11(D:O) IC373.10(C:I1)
N$1019: IC372.6(B:O) IC373.12(D:I0)
N$1020: IC372.11(D:O) IC373.13(D:I1)
N$1021: IC374.6(B:O) IC378.1(A:I0)
N$1022: IC374.11(D:O) IC378.2(A:I1)
N$1023: IC375.6(B:O) IC378.4(B:I0)
N$1024: IC375.11(D:O) IC378.5(B:I1)
N$1025: IC376.6(B:O) IC378.9(C:I0)
N$1026: IC376.11(D:O) IC378.10(C:I1)
N$1035: IC358.3(A:O) IC358.4(B:I0) IC358.5(B:I1)
N$1036: IC358.8(C:O) IC358.12(D:I0) IC358.13(D:I1)
N$1037: IC359.3(A:O) IC359.4(B:I0) IC359.5(B:I1)
N$1038: IC358.11(D:O) IC363.2(A:I1)
N$1039: IC358.6(B:O) IC363.1(A:I0)
N$1040: IC359.6(B:O) IC363.4(B:I0)
N$1041: IC359.11(D:O) IC363.5(B:I1)
N$1042: IC360.6(B:O) IC363.9(C:I0)
N$1043: IC360.11(D:O) IC363.10(C:I1)
N$1044: IC362.6(B:O) IC363.12(D:I0)
N$1045: IC362.11(D:O) IC363.13(D:I1)
N$1046: IC364.6(B:O) IC368.1(A:I0)
N$1047: IC364.11(D:O) IC368.2(A:I1)
N$1048: IC365.6(B:O) IC368.4(B:I0)
N$1049: IC365.11(D:O) IC368.5(B:I1)
N$1050: IC366.6(B:O) IC368.9(C:I0)
N$1051: IC366.11(D:O) IC368.10(C:I1)
N$1052: IC367.6(B:O) IC368.12(D:I0)
N$1053: IC367.11(D:O) IC368.13(D:I1)
N$1054: IC367.8(C:O) IC367.12(D:I0) IC367.13(D:I1)
N$1055: IC367.3(A:O) IC367.4(B:I0) IC367.5(B:I1)
N$1056: IC366.8(C:O) IC366.12(D:I0) IC366.13(D:I1)
N$1057: IC366.3(A:O) IC366.4(B:I0) IC366.5(B:I1)
N$1058: IC365.8(C:O) IC365.12(D:I0) IC365.13(D:I1)
N$1059: IC365.3(A:O) IC365.4(B:I0) IC365.5(B:I1)
N$1060: IC364.8(C:O) IC364.12(D:I0) IC364.13(D:I1)
N$1061: IC364.3(A:O) IC364.4(B:I0) IC364.5(B:I1)
N$1062: IC362.8(C:O) IC362.12(D:I0) IC362.13(D:I1)
N$1063: IC362.3(A:O) IC362.4(B:I0) IC362.5(B:I1)
N$1064: IC360.8(C:O) IC360.12(D:I0) IC360.13(D:I1)
N$1065: IC360.3(A:O) IC360.4(B:I0) IC360.5(B:I1)
N$1066: IC359.8(C:O) IC359.12(D:I0) IC359.13(D:I1)
OP4: IC359.10(C:I1) IC361.12(D:I0) IC361.13(D:I1) IC362.10(C:I1) IC365.10(C:I1) IC367.10(C:I1) IC370.10(C:I1) IC372.10(C:I1) IC375.10(C:I1) IC377.10(C:I1) ; also sheet 44,47
OP5: IC360.9(C:I0) IC361.9(C:I0) IC361.10(C:I1) IC362.9(C:I0) IC366.9(C:I0) IC367.9(C:I0) IC371.9(C:I0) IC372.9(C:I0) IC376.9(C:I0) IC377.9(C:I0) ; also sheet 44,47
OP6: IC361.4(B:I0) IC361.5(B:I1) IC364.2(A:I1) IC365.2(A:I1) IC366.2(A:I1) IC367.2(A:I1) IC374.2(A:I1) IC375.2(A:I1) IC376.2(A:I1) IC377.2(A:I1) ; also sheet 44,47
OP7: IC361.1(A:I0) IC361.2(A:I1) IC369.1(A:I0) IC370.1(A:I0) IC371.1(A:I0) IC372.1(A:I0) IC374.1(A:I0) IC375.1(A:I0) IC376.1(A:I0) IC377.1(A:I0) ; also sheet 44,47
OPN4: IC358.10(C:I1) IC360.10(C:I1) IC361.11(D:O) IC364.10(C:I1) IC366.10(C:I1) IC369.10(C:I1) IC371.10(C:I1) IC374.10(C:I1) IC376.10(C:I1)
OPN5: IC358.9(C:I0) IC359.9(C:I0) IC361.8(C:O) IC364.9(C:I0) IC365.9(C:I0) IC369.9(C:I0) IC370.9(C:I0) IC374.9(C:I0) IC375.9(C:I0)
OPN6: IC358.2(A:I1) IC359.2(A:I1) IC360.2(A:I1) IC361.6(B:O) IC362.2(A:I1) IC369.2(A:I1) IC370.2(A:I1) IC371.2(A:I1) IC372.2(A:I1)
OPN7: IC358.1(A:I0) IC359.1(A:I0) IC360.1(A:I0) IC361.3(A:O) IC362.1(A:I0) IC364.1(A:I0) IC365.1(A:I0) IC366.1(A:I0) IC367.1(A:I0)
RSELA0: IC363.3(A:O) ; also sheet 40,41
RSELA1: IC363.6(B:O) ; also sheet 40,41
RSELA2: IC363.8(C:O) ; also sheet 40,41
RSELA3: IC363.11(D:O) ; also sheet 40,41
RSELA4: IC368.3(A:O) ; also sheet 40,41,42
RSELA5: IC368.6(B:O) ; also sheet 40,41
RSELA6: IC368.8(C:O) ; also sheet 40,41
RSELA7: IC368.11(D:O) ; also sheet 40,41
RSELA8: IC373.3(A:O) ; also sheet 40,41
RSELA9: IC373.6(B:O) ; also sheet 40,41
RSELA10: IC373.8(C:O) ; also sheet 40,41
RSELA11: IC373.11(D:O) ; also sheet 40,41
RSELA12: IC378.3(A:O) ; also sheet 40,41
RSELA13: IC378.6(B:O) ; also sheet 40,41
RSELA14: IC378.8(C:O) ; also sheet 40,41
RSELA15: IC378.11(D:O) ; also sheet 40,41
VCC: IC358.14(P:VCC) IC359.14(P:VCC) IC360.14(P:VCC) IC361.14(P:VCC) IC362.14(P:VCC) IC363.14(P:VCC) IC364.14(P:VCC) IC365.14(P:VCC) IC366.14(P:VCC) IC367.14(P:VCC) IC368.14(P:VCC) IC369.14(P:VCC) IC370.14(P:VCC) IC371.14(P:VCC) IC372.14(P:VCC) IC373.14(P:VCC) IC374.14(P:VCC) IC375.14(P:VCC) IC376.14(P:VCC) IC377.14(P:VCC) IC378.14(P:VCC) ; also sheet 1,2,3,4,5,6,7,8,9,10,11,12,13,14,15,16,17,18,19,20,21,22,23,24,25,26,27,28,29,30,31,32,33,34,37,39,40,41,42,43,44,45,46,47

## Sheet 39 of 48: rselb
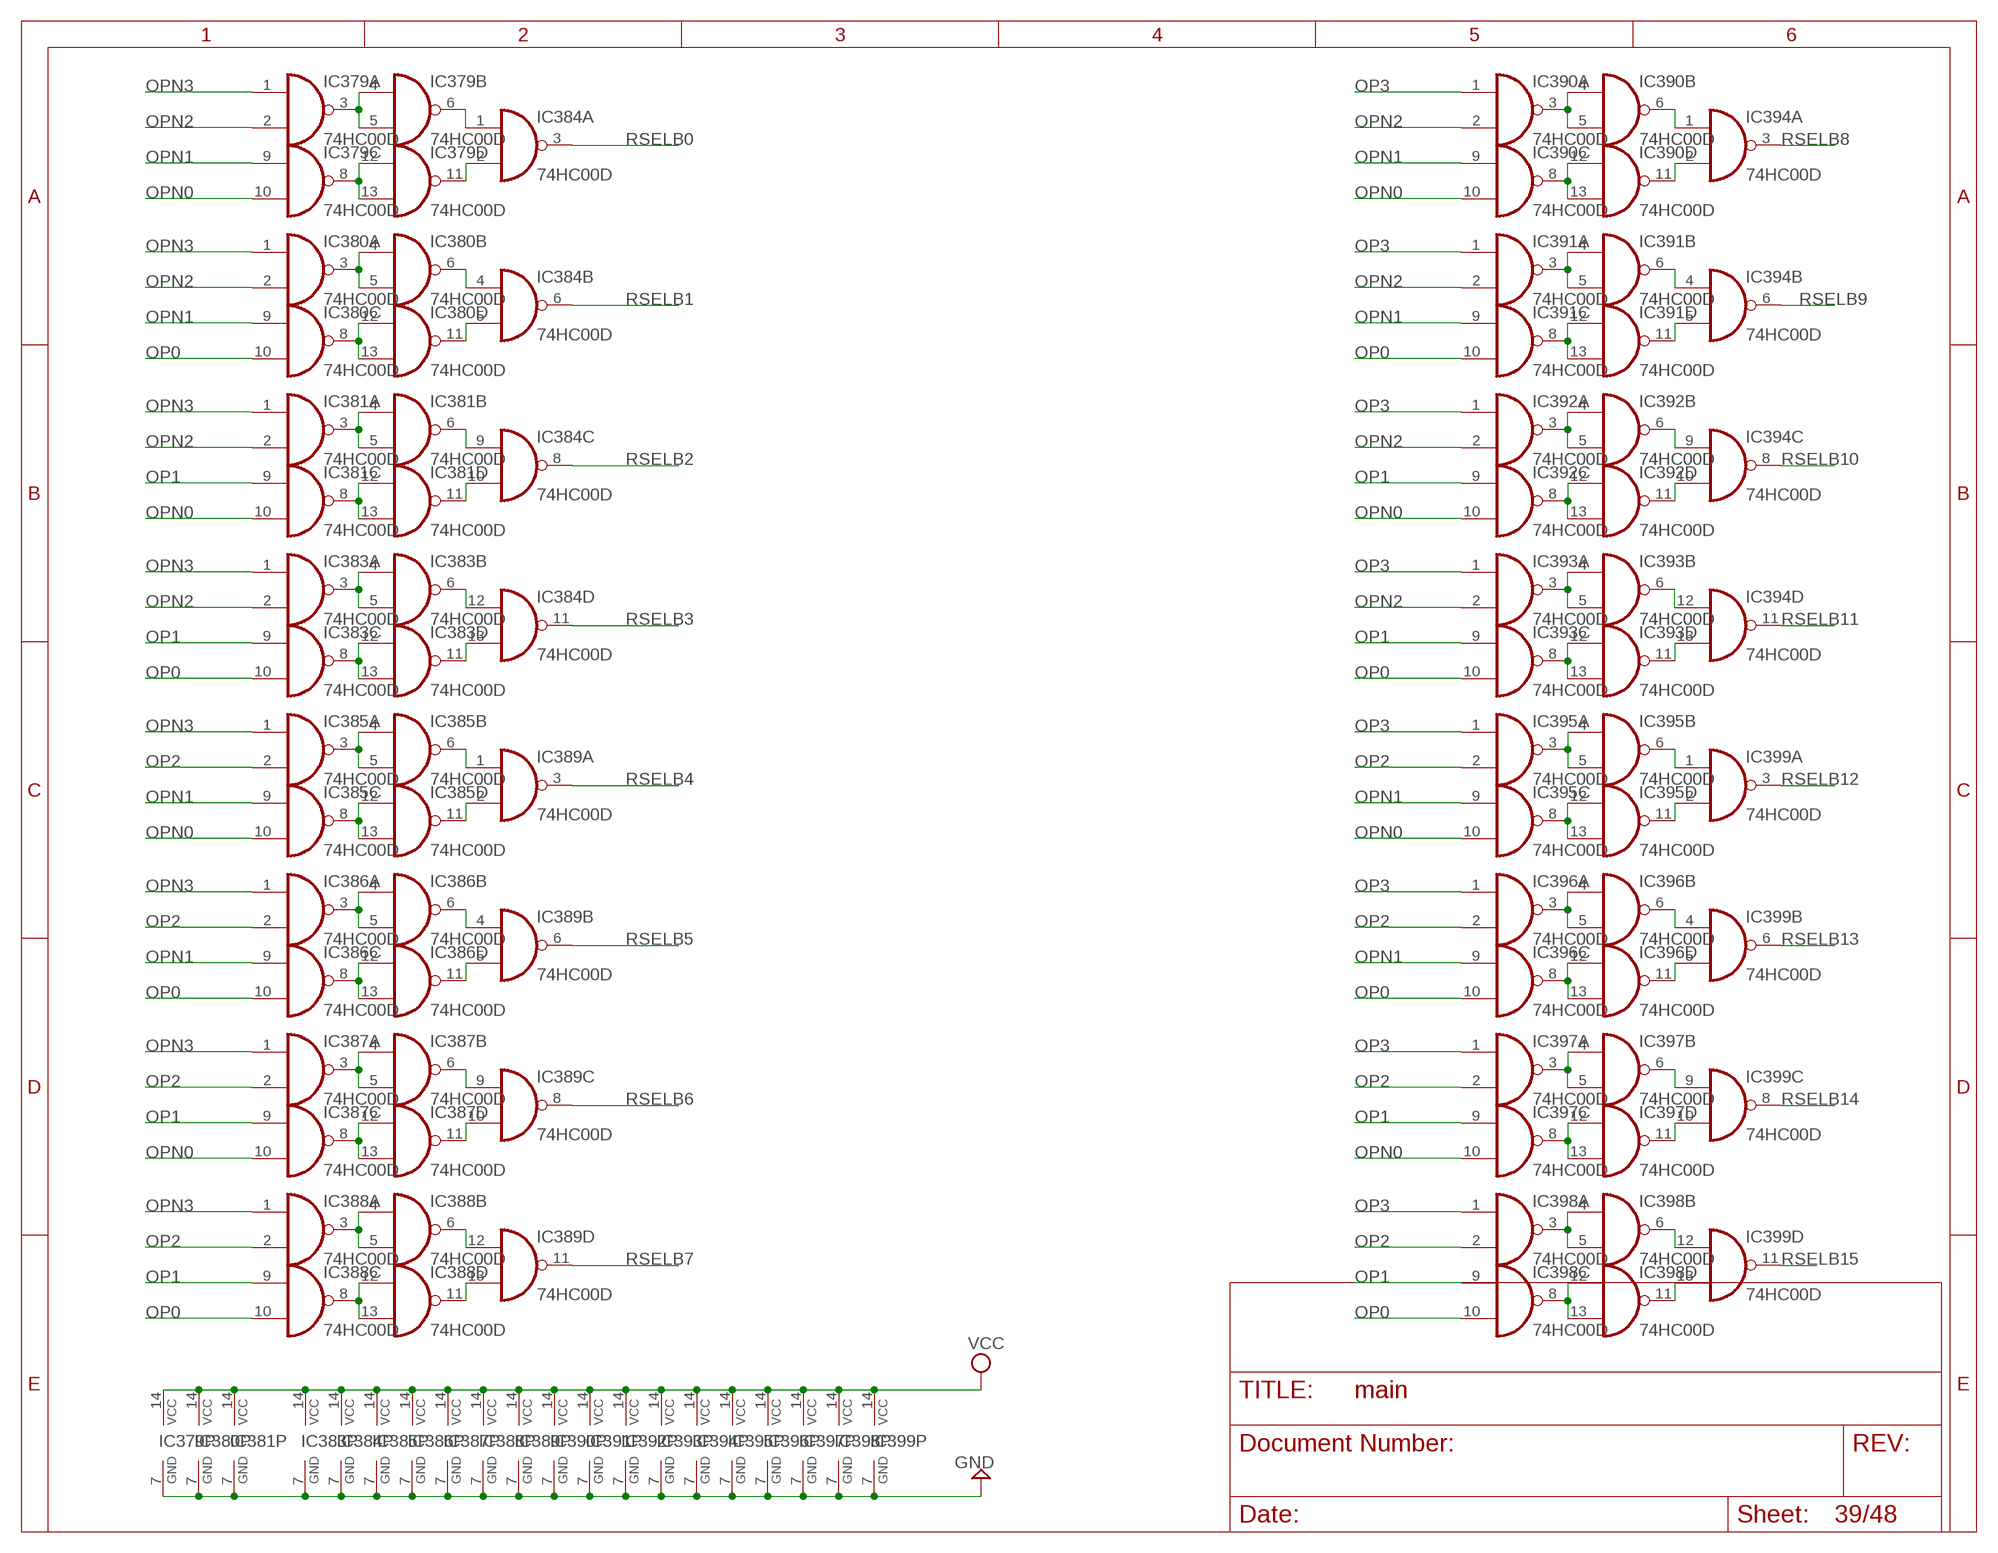
[diagram p37: schematic, sheet 39]

### Parts
IC379  74HC00D  [SO14]
IC380  74HC00D  [SO14]
IC381  74HC00D  [SO14]
IC383  74HC00D  [SO14]
IC384  74HC00D  [SO14]
IC385  74HC00D  [SO14]
IC386  74HC00D  [SO14]
IC387  74HC00D  [SO14]
IC388  74HC00D  [SO14]
IC389  74HC00D  [SO14]
IC390  74HC00D  [SO14]
IC391  74HC00D  [SO14]
IC392  74HC00D  [SO14]
IC393  74HC00D  [SO14]
IC394  74HC00D  [SO14]
IC395  74HC00D  [SO14]
IC396  74HC00D  [SO14]
IC397  74HC00D  [SO14]
IC398  74HC00D  [SO14]
IC399  74HC00D  [SO14]

### Nets
GND: IC379.7(P:GND) IC380.7(P:GND) IC381.7(P:GND) IC383.7(P:GND) IC384.7(P:GND) IC385.7(P:GND) IC386.7(P:GND) IC387.7(P:GND) IC388.7(P:GND) IC389.7(P:GND) IC390.7(P:GND) IC391.7(P:GND) IC392.7(P:GND) IC393.7(P:GND) IC394.7(P:GND) IC395.7(P:GND) IC396.7(P:GND) IC397.7(P:GND) IC398.7(P:GND) IC399.7(P:GND) ; also sheet 1,2,3,4,5,6,7,8,9,10,11,12,13,14,15,16,17,18,19,20,21,22,23,24,25,26,27,28,29,30,31,32,33,34,37,38,40,41,42,43,44,45,46,47
N$1141: IC398.6(B:O) IC399.12(D:I0)
N$1142: IC398.11(D:O) IC399.13(D:I1)
N$1143: IC398.8(C:O) IC398.12(D:I0) IC398.13(D:I1)
N$1144: IC398.3(A:O) IC398.4(B:I0) IC398.5(B:I1)
N$1145: IC397.8(C:O) IC397.12(D:I0) IC397.13(D:I1)
N$1146: IC397.3(A:O) IC397.4(B:I0) IC397.5(B:I1)
N$1147: IC396.8(C:O) IC396.12(D:I0) IC396.13(D:I1)
N$1148: IC396.3(A:O) IC396.4(B:I0) IC396.5(B:I1)
N$1149: IC395.8(C:O) IC395.12(D:I0) IC395.13(D:I1)
N$1150: IC395.3(A:O) IC395.4(B:I0) IC395.5(B:I1)
N$1151: IC393.8(C:O) IC393.12(D:I0) IC393.13(D:I1)
N$1152: IC393.3(A:O) IC393.4(B:I0) IC393.5(B:I1)
N$1153: IC392.8(C:O) IC392.12(D:I0) IC392.13(D:I1)
N$1154: IC392.3(A:O) IC392.4(B:I0) IC392.5(B:I1)
N$1155: IC391.8(C:O) IC391.12(D:I0) IC391.13(D:I1)
N$1156: IC391.3(A:O) IC391.4(B:I0) IC391.5(B:I1)
N$1157: IC390.8(C:O) IC390.12(D:I0) IC390.13(D:I1)
N$1158: IC390.3(A:O) IC390.4(B:I0) IC390.5(B:I1)
N$1159: IC390.6(B:O) IC394.1(A:I0)
N$1160: IC390.11(D:O) IC394.2(A:I1)
N$1161: IC391.6(B:O) IC394.4(B:I0)
N$1162: IC391.11(D:O) IC394.5(B:I1)
N$1163: IC392.6(B:O) IC394.9(C:I0)
N$1164: IC392.11(D:O) IC394.10(C:I1)
N$1165: IC393.6(B:O) IC394.12(D:I0)
N$1166: IC393.11(D:O) IC394.13(D:I1)
N$1167: IC395.6(B:O) IC399.1(A:I0)
N$1168: IC395.11(D:O) IC399.2(A:I1)
N$1169: IC396.6(B:O) IC399.4(B:I0)
N$1170: IC396.11(D:O) IC399.5(B:I1)
N$1171: IC397.6(B:O) IC399.9(C:I0)
N$1172: IC397.11(D:O) IC399.10(C:I1)
N$1173: IC379.3(A:O) IC379.4(B:I0) IC379.5(B:I1)
N$1174: IC379.8(C:O) IC379.12(D:I0) IC379.13(D:I1)
N$1175: IC380.3(A:O) IC380.4(B:I0) IC380.5(B:I1)
N$1176: IC379.11(D:O) IC384.2(A:I1)
N$1177: IC379.6(B:O) IC384.1(A:I0)
N$1178: IC380.6(B:O) IC384.4(B:I0)
N$1179: IC380.11(D:O) IC384.5(B:I1)
N$1180: IC381.6(B:O) IC384.9(C:I0)
N$1181: IC381.11(D:O) IC384.10(C:I1)
N$1182: IC383.6(B:O) IC384.12(D:I0)
N$1183: IC383.11(D:O) IC384.13(D:I1)
N$1184: IC385.6(B:O) IC389.1(A:I0)
N$1185: IC385.11(D:O) IC389.2(A:I1)
N$1186: IC386.6(B:O) IC389.4(B:I0)
N$1187: IC386.11(D:O) IC389.5(B:I1)
N$1188: IC387.6(B:O) IC389.9(C:I0)
N$1189: IC387.11(D:O) IC389.10(C:I1)
N$1190: IC388.6(B:O) IC389.12(D:I0)
N$1191: IC388.11(D:O) IC389.13(D:I1)
N$1192: IC388.8(C:O) IC388.12(D:I0) IC388.13(D:I1)
N$1193: IC388.3(A:O) IC388.4(B:I0) IC388.5(B:I1)
N$1194: IC387.8(C:O) IC387.12(D:I0) IC387.13(D:I1)
N$1195: IC387.3(A:O) IC387.4(B:I0) IC387.5(B:I1)
N$1196: IC386.8(C:O) IC386.12(D:I0) IC386.13(D:I1)
N$1197: IC386.3(A:O) IC386.4(B:I0) IC386.5(B:I1)
N$1198: IC385.8(C:O) IC385.12(D:I0) IC385.13(D:I1)
N$1199: IC385.3(A:O) IC385.4(B:I0) IC385.5(B:I1)
N$1200: IC383.8(C:O) IC383.12(D:I0) IC383.13(D:I1)
N$1201: IC383.3(A:O) IC383.4(B:I0) IC383.5(B:I1)
N$1202: IC381.8(C:O) IC381.12(D:I0) IC381.13(D:I1)
N$1203: IC381.3(A:O) IC381.4(B:I0) IC381.5(B:I1)
N$1204: IC380.8(C:O) IC380.12(D:I0) IC380.13(D:I1)
OP0: IC380.10(C:I1) IC383.10(C:I1) IC386.10(C:I1) IC388.10(C:I1) IC391.10(C:I1) IC393.10(C:I1) IC396.10(C:I1) IC398.10(C:I1) ; also sheet 29,30,45,46,47
OP1: IC381.9(C:I0) IC383.9(C:I0) IC387.9(C:I0) IC388.9(C:I0) IC392.9(C:I0) IC393.9(C:I0) IC397.9(C:I0) IC398.9(C:I0) ; also sheet 29,30,45,46,47
OP2: IC385.2(A:I1) IC386.2(A:I1) IC387.2(A:I1) IC388.2(A:I1) IC395.2(A:I1) IC396.2(A:I1) IC397.2(A:I1) IC398.2(A:I1) ; also sheet 29,30,37,45,46,47
OP3: IC390.1(A:I0) IC391.1(A:I0) IC392.1(A:I0) IC393.1(A:I0) IC395.1(A:I0) IC396.1(A:I0) IC397.1(A:I0) IC398.1(A:I0) ; also sheet 29,30,45,47
OPN0: IC379.10(C:I1) IC381.10(C:I1) IC385.10(C:I1) IC387.10(C:I1) IC390.10(C:I1) IC392.10(C:I1) IC395.10(C:I1) IC397.10(C:I1) ; also sheet 30,46
OPN1: IC379.9(C:I0) IC380.9(C:I0) IC385.9(C:I0) IC386.9(C:I0) IC390.9(C:I0) IC391.9(C:I0) IC395.9(C:I0) IC396.9(C:I0) ; also sheet 30,46
OPN2: IC379.2(A:I1) IC380.2(A:I1) IC381.2(A:I1) IC383.2(A:I1) IC390.2(A:I1) IC391.2(A:I1) IC392.2(A:I1) IC393.2(A:I1) ; also sheet 30,37,46
OPN3: IC379.1(A:I0) IC380.1(A:I0) IC381.1(A:I0) IC383.1(A:I0) IC385.1(A:I0) IC386.1(A:I0) IC387.1(A:I0) IC388.1(A:I0) ; also sheet 30
RSELB0: IC384.3(A:O) ; also sheet 42,43
RSELB1: IC384.6(B:O) ; also sheet 42,43
RSELB2: IC384.8(C:O) ; also sheet 42,43
RSELB3: IC384.11(D:O) ; also sheet 42,43
RSELB4: IC389.3(A:O) ; also sheet 43
RSELB5: IC389.6(B:O) ; also sheet 42,43
RSELB6: IC389.8(C:O) ; also sheet 42,43
RSELB7: IC389.11(D:O) ; also sheet 42,43
RSELB8: IC394.3(A:O) ; also sheet 42,43
RSELB9: IC394.6(B:O) ; also sheet 42,43
RSELB10: IC394.8(C:O) ; also sheet 42,43
RSELB11: IC394.11(D:O) ; also sheet 42,43
RSELB12: IC399.3(A:O) ; also sheet 42,43
RSELB13: IC399.6(B:O) ; also sheet 42,43
RSELB14: IC399.8(C:O) ; also sheet 42,43
RSELB15: IC399.11(D:O) ; also sheet 42,43
VCC: IC379.14(P:VCC) IC380.14(P:VCC) IC381.14(P:VCC) IC383.14(P:VCC) IC384.14(P:VCC) IC385.14(P:VCC) IC386.14(P:VCC) IC387.14(P:VCC) IC388.14(P:VCC) IC389.14(P:VCC) IC390.14(P:VCC) IC391.14(P:VCC) IC392.14(P:VCC) IC393.14(P:VCC) IC394.14(P:VCC) IC395.14(P:VCC) IC396.14(P:VCC) IC397.14(P:VCC) IC398.14(P:VCC) IC399.14(P:VCC) ; also sheet 1,2,3,4,5,6,7,8,9,10,11,12,13,14,15,16,17,18,19,20,21,22,23,24,25,26,27,28,29,30,31,32,33,34,37,38,40,41,42,43,44,45,46,47

## Sheet 40 of 48: rega mux
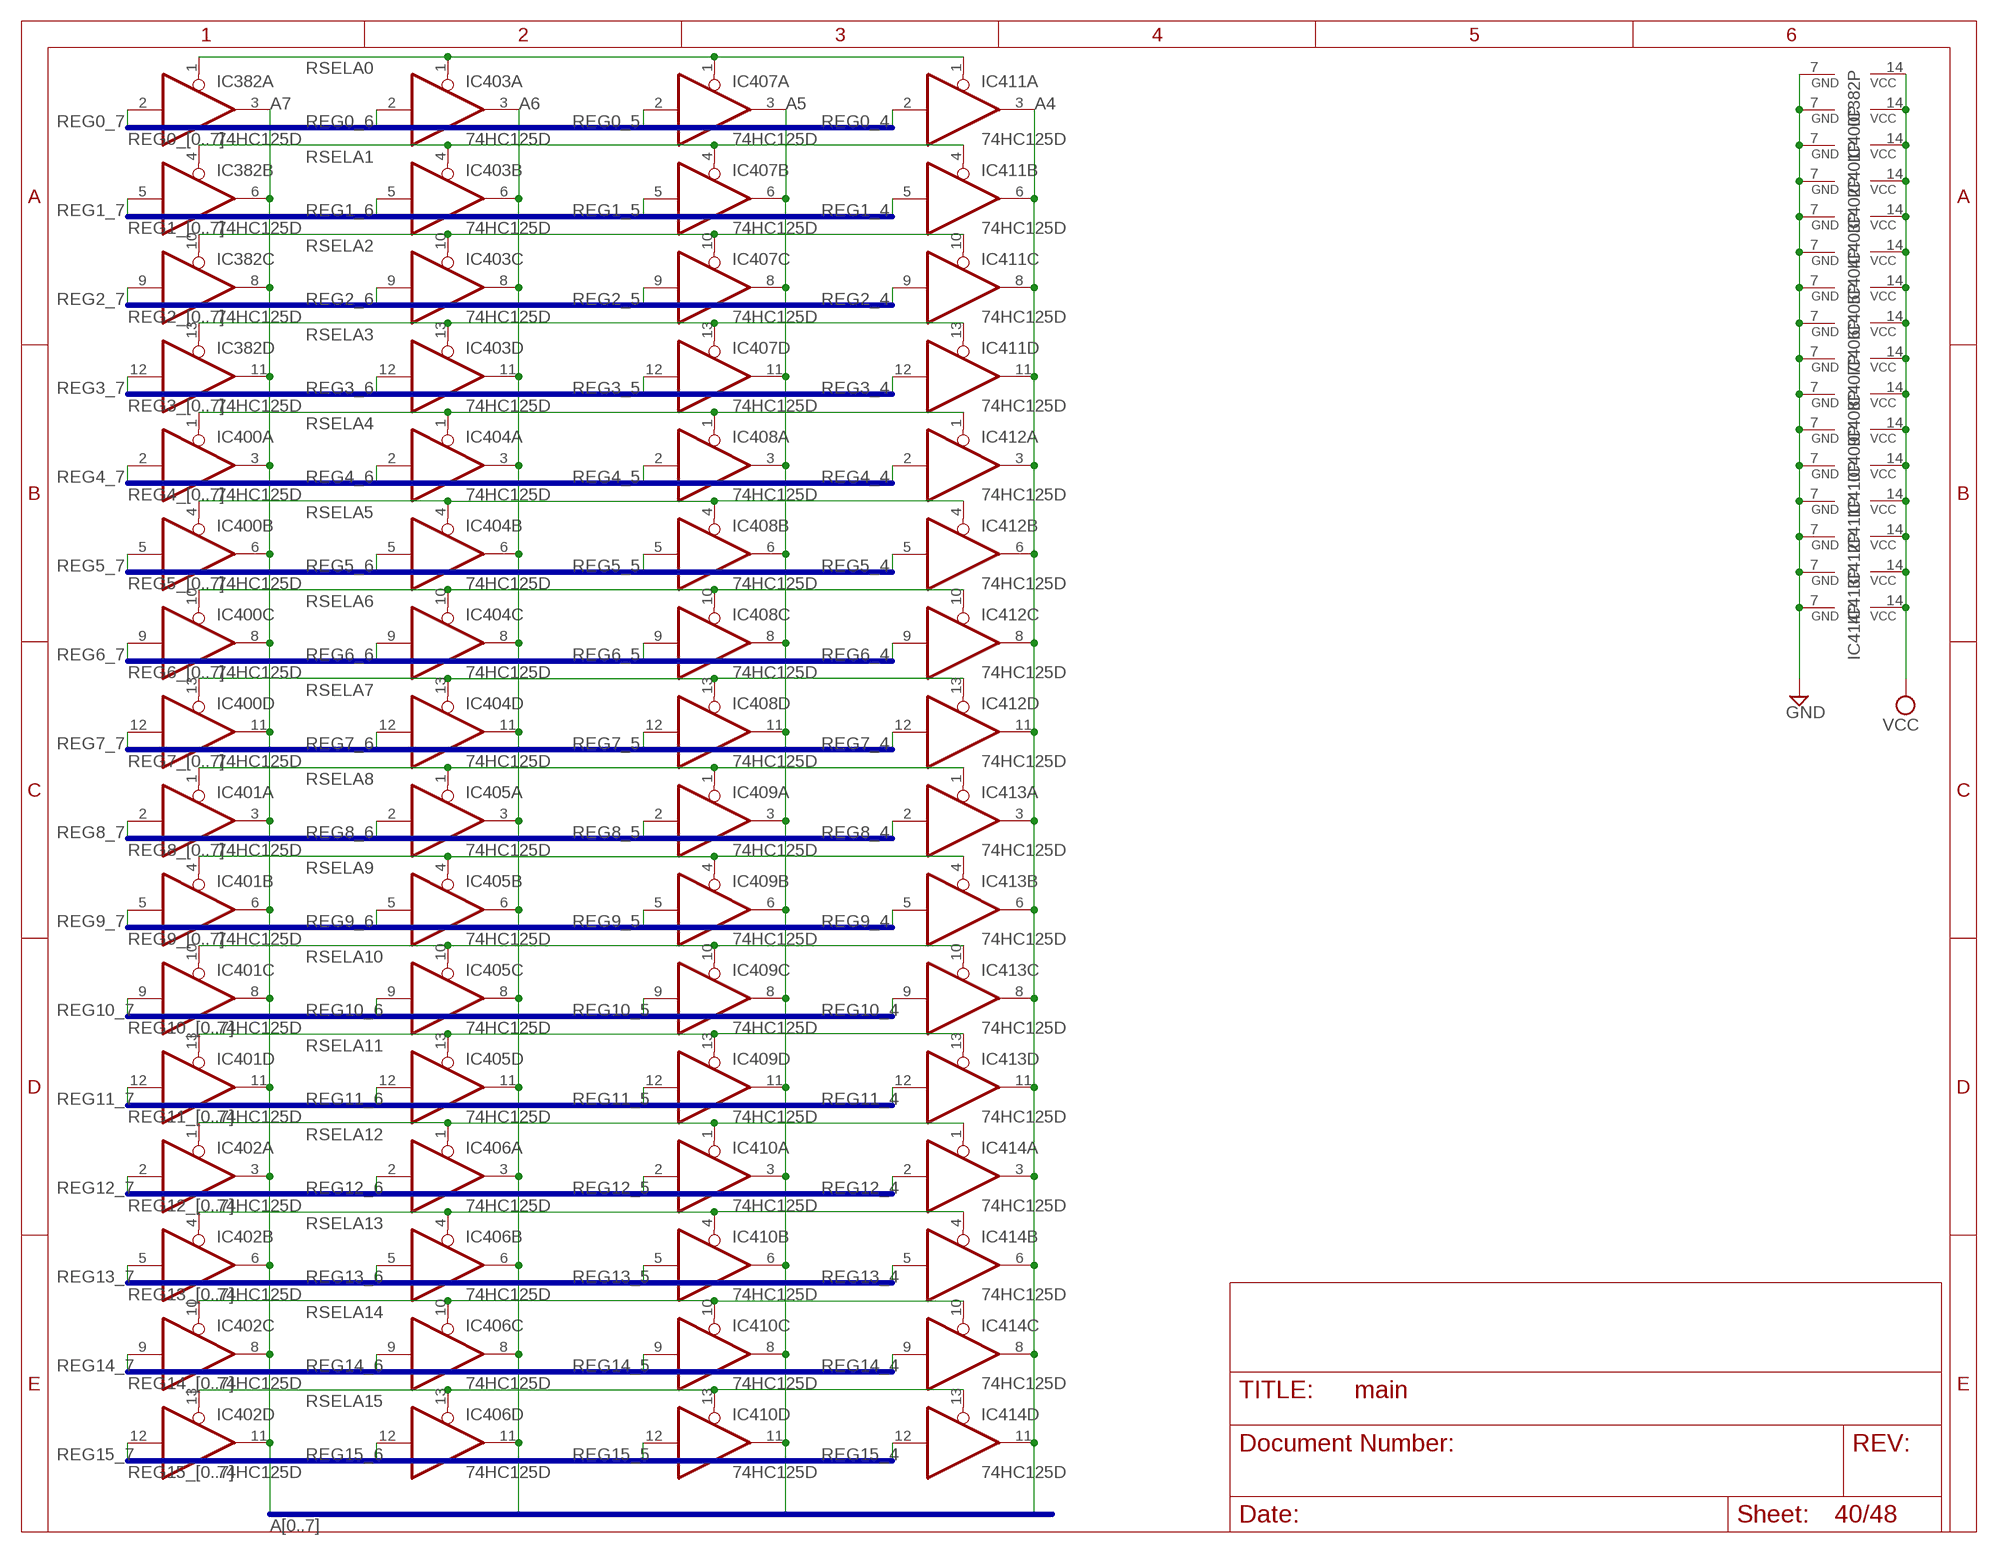
[diagram p38: schematic, sheet 40]

### Parts
IC382  74HC125D  [SO14]
IC400  74HC125D  [SO14]
IC401  74HC125D  [SO14]
IC402  74HC125D  [SO14]
IC403  74HC125D  [SO14]
IC404  74HC125D  [SO14]
IC405  74HC125D  [SO14]
IC406  74HC125D  [SO14]
IC407  74HC125D  [SO14]
IC408  74HC125D  [SO14]
IC409  74HC125D  [SO14]
IC410  74HC125D  [SO14]
IC411  74HC125D  [SO14]
IC412  74HC125D  [SO14]
IC413  74HC125D  [SO14]
IC414  74HC125D  [SO14]

### Nets
A4: IC411.3(A:O) IC411.6(B:O) IC411.8(C:O) IC411.11(D:O) IC412.3(A:O) IC412.6(B:O) IC412.8(C:O) IC412.11(D:O) IC413.3(A:O) IC413.6(B:O) IC413.8(C:O) IC413.11(D:O) IC414.3(A:O) IC414.6(B:O) IC414.8(C:O) IC414.11(D:O) ; also sheet 2,24,25,27,30,34
A5: IC407.3(A:O) IC407.6(B:O) IC407.8(C:O) IC407.11(D:O) IC408.3(A:O) IC408.6(B:O) IC408.8(C:O) IC408.11(D:O) IC409.3(A:O) IC409.6(B:O) IC409.8(C:O) IC409.11(D:O) IC410.3(A:O) IC410.6(B:O) IC410.8(C:O) IC410.11(D:O) ; also sheet 2,7,8,11,16,24,25,27,30,34
A6: IC403.3(A:O) IC403.6(B:O) IC403.8(C:O) IC403.11(D:O) IC404.3(A:O) IC404.6(B:O) IC404.8(C:O) IC404.11(D:O) IC405.3(A:O) IC405.6(B:O) IC405.8(C:O) IC405.11(D:O) IC406.3(A:O) IC406.6(B:O) IC406.8(C:O) IC406.11(D:O) ; also sheet 2,24,25,27,30,34
A7: IC382.3(A:O) IC382.6(B:O) IC382.8(C:O) IC382.11(D:O) IC400.3(A:O) IC400.6(B:O) IC400.8(C:O) IC400.11(D:O) IC401.3(A:O) IC401.6(B:O) IC401.8(C:O) IC401.11(D:O) IC402.3(A:O) IC402.6(B:O) IC402.8(C:O) IC402.11(D:O) ; also sheet 2,9,10,11,15,24,25,27,30,34
GND: IC382.7(P:GND) IC400.7(P:GND) IC401.7(P:GND) IC402.7(P:GND) IC403.7(P:GND) IC404.7(P:GND) IC405.7(P:GND) IC406.7(P:GND) IC407.7(P:GND) IC408.7(P:GND) IC409.7(P:GND) IC410.7(P:GND) IC411.7(P:GND) IC412.7(P:GND) IC413.7(P:GND) IC414.7(P:GND) ; also sheet 1,2,3,4,5,6,7,8,9,10,11,12,13,14,15,16,17,18,19,20,21,22,23,24,25,26,27,28,29,30,31,32,33,34,37,38,39,41,42,43,44,45,46,47
REG0_4: IC411.2(A:I) ; also sheet 42
REG0_5: IC407.2(A:I) ; also sheet 42
REG0_6: IC403.2(A:I) ; also sheet 42
REG0_7: IC382.2(A:I) ; also sheet 42
REG1_4: IC411.5(B:I) ; also sheet 42
REG1_5: IC407.5(B:I) ; also sheet 42
REG1_6: IC403.5(B:I) ; also sheet 42
REG1_7: IC382.5(B:I) ; also sheet 42
REG2_4: IC411.9(C:I) ; also sheet 42
REG2_5: IC407.9(C:I) ; also sheet 42
REG2_6: IC403.9(C:I) ; also sheet 42
REG2_7: IC382.9(C:I) ; also sheet 42
REG3_4: IC411.12(D:I) ; also sheet 42
REG3_5: IC407.12(D:I) ; also sheet 42
REG3_6: IC403.12(D:I) ; also sheet 42
REG3_7: IC382.12(D:I) ; also sheet 42
REG4_4: IC412.2(A:I) ; also sheet 42
REG4_5: IC408.2(A:I) ; also sheet 42
REG4_6: IC404.2(A:I) ; also sheet 42
REG4_7: IC400.2(A:I) ; also sheet 42
REG5_4: IC412.5(B:I) ; also sheet 42
REG5_5: IC408.5(B:I) ; also sheet 42
REG5_6: IC404.5(B:I) ; also sheet 42
REG5_7: IC400.5(B:I) ; also sheet 42
REG6_4: IC412.9(C:I) ; also sheet 42
REG6_5: IC408.9(C:I) ; also sheet 42
REG6_6: IC404.9(C:I) ; also sheet 42
REG6_7: IC400.9(C:I) ; also sheet 42
REG7_4: IC412.12(D:I) ; also sheet 42
REG7_5: IC408.12(D:I) ; also sheet 42
REG7_6: IC404.12(D:I) ; also sheet 42
REG7_7: IC400.12(D:I) ; also sheet 42
REG8_4: IC413.2(A:I) ; also sheet 42
REG8_5: IC409.2(A:I) ; also sheet 42
REG8_6: IC405.2(A:I) ; also sheet 42
REG8_7: IC401.2(A:I) ; also sheet 42
REG9_4: IC413.5(B:I) ; also sheet 42
REG9_5: IC409.5(B:I) ; also sheet 42
REG9_6: IC405.5(B:I) ; also sheet 42
REG9_7: IC401.5(B:I) ; also sheet 42
REG10_4: IC413.9(C:I) ; also sheet 42
REG10_5: IC409.9(C:I) ; also sheet 42
REG10_6: IC405.9(C:I) ; also sheet 42
REG10_7: IC401.9(C:I) ; also sheet 42
REG11_4: IC413.12(D:I) ; also sheet 42
REG11_5: IC409.12(D:I) ; also sheet 42
REG11_6: IC405.12(D:I) ; also sheet 42
REG11_7: IC401.12(D:I) ; also sheet 42
REG12_4: IC414.2(A:I) ; also sheet 42
REG12_5: IC410.2(A:I) ; also sheet 42
REG12_6: IC406.2(A:I) ; also sheet 42
REG12_7: IC402.2(A:I) ; also sheet 42
REG13_4: IC414.5(B:I) ; also sheet 42
REG13_5: IC410.5(B:I) ; also sheet 42
REG13_6: IC406.5(B:I) ; also sheet 42
REG13_7: IC402.5(B:I) ; also sheet 42
REG14_4: IC414.9(C:I) ; also sheet 42,47
REG14_5: IC410.9(C:I) ; also sheet 42,47
REG14_6: IC406.9(C:I) ; also sheet 42,47
REG14_7: IC402.9(C:I) ; also sheet 42,47
REG15_4: IC414.12(D:I) ; also sheet 42
REG15_5: IC410.12(D:I) ; also sheet 42,48
REG15_6: IC406.12(D:I) ; also sheet 42,48
REG15_7: IC402.12(D:I) ; also sheet 42,48
RSELA0: IC382.1(A:OE) IC403.1(A:OE) IC407.1(A:OE) IC411.1(A:OE) ; also sheet 38,41
RSELA1: IC382.4(B:OE) IC403.4(B:OE) IC407.4(B:OE) IC411.4(B:OE) ; also sheet 38,41
RSELA2: IC382.10(C:OE) IC403.10(C:OE) IC407.10(C:OE) IC411.10(C:OE) ; also sheet 38,41
RSELA3: IC382.13(D:OE) IC403.13(D:OE) IC407.13(D:OE) IC411.13(D:OE) ; also sheet 38,41
RSELA4: IC400.1(A:OE) IC404.1(A:OE) IC408.1(A:OE) IC412.1(A:OE) ; also sheet 38,41,42
RSELA5: IC400.4(B:OE) IC404.4(B:OE) IC408.4(B:OE) IC412.4(B:OE) ; also sheet 38,41
RSELA6: IC400.10(C:OE) IC404.10(C:OE) IC408.10(C:OE) IC412.10(C:OE) ; also sheet 38,41
RSELA7: IC400.13(D:OE) IC404.13(D:OE) IC408.13(D:OE) IC412.13(D:OE) ; also sheet 38,41
RSELA8: IC401.1(A:OE) IC405.1(A:OE) IC409.1(A:OE) IC413.1(A:OE) ; also sheet 38,41
RSELA9: IC401.4(B:OE) IC405.4(B:OE) IC409.4(B:OE) IC413.4(B:OE) ; also sheet 38,41
RSELA10: IC401.10(C:OE) IC405.10(C:OE) IC409.10(C:OE) IC413.10(C:OE) ; also sheet 38,41
RSELA11: IC401.13(D:OE) IC405.13(D:OE) IC409.13(D:OE) IC413.13(D:OE) ; also sheet 38,41
RSELA12: IC402.1(A:OE) IC406.1(A:OE) IC410.1(A:OE) IC414.1(A:OE) ; also sheet 38,41
RSELA13: IC402.4(B:OE) IC406.4(B:OE) IC410.4(B:OE) IC414.4(B:OE) ; also sheet 38,41
RSELA14: IC402.10(C:OE) IC406.10(C:OE) IC410.10(C:OE) IC414.10(C:OE) ; also sheet 38,41
RSELA15: IC402.13(D:OE) IC406.13(D:OE) IC410.13(D:OE) IC414.13(D:OE) ; also sheet 38,41
VCC: IC382.14(P:VCC) IC400.14(P:VCC) IC401.14(P:VCC) IC402.14(P:VCC) IC403.14(P:VCC) IC404.14(P:VCC) IC405.14(P:VCC) IC406.14(P:VCC) IC407.14(P:VCC) IC408.14(P:VCC) IC409.14(P:VCC) IC410.14(P:VCC) IC411.14(P:VCC) IC412.14(P:VCC) IC413.14(P:VCC) IC414.14(P:VCC) ; also sheet 1,2,3,4,5,6,7,8,9,10,11,12,13,14,15,16,17,18,19,20,21,22,23,24,25,26,27,28,29,30,31,32,33,34,37,38,39,41,42,43,44,45,46,47

### Buses
A[0..7]
REG0_[0..7]
REG1_[0..7]
REG3_[0..7]
REG4_[0..7]
REG5_[0..7]
REG6_[0..7]
REG7_[0..7]
REG8_[0..7]
REG9_[0..7]
REG10_[0..7]
REG11_[0..7]
REG12_[0..7]
REG13_[0..7]
REG14_[0..7]
REG15_[0..7]
REG2_[0..7]